# Altium project PMSM_Motor_Controller_v2_2023.PrjPcb (part 1 of 2)
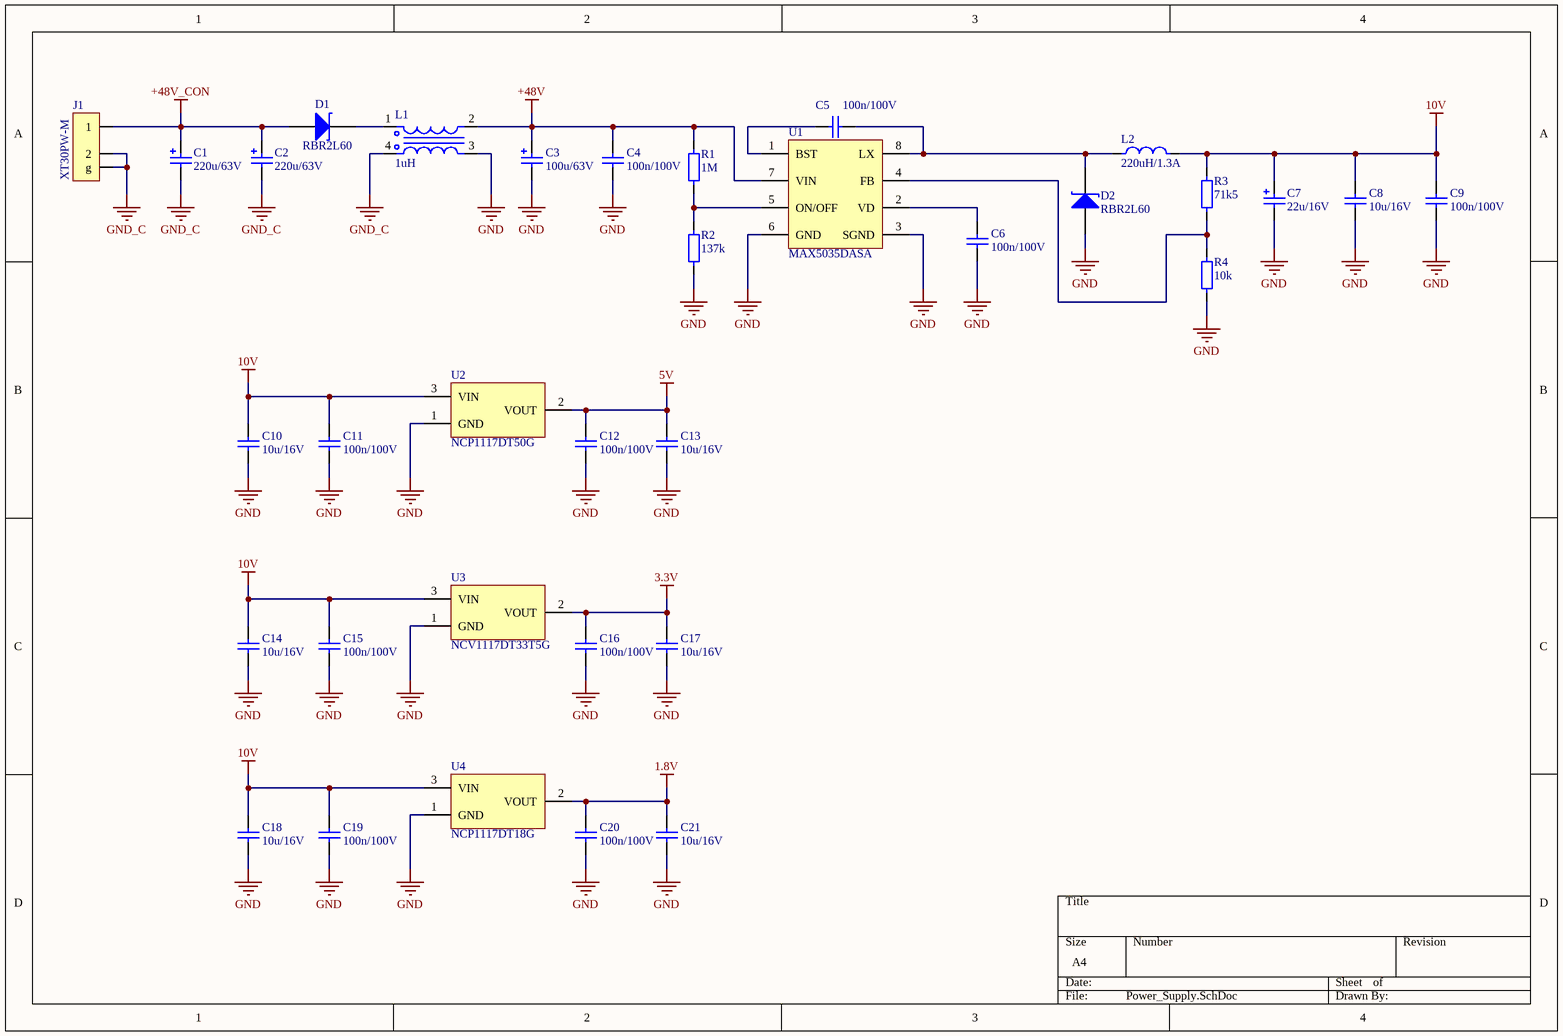
[diagram p0: Power_Supply.SchDoc]
7 sheets, 291 parts. Net scope: global (net labels, ports and power ports of the same name join across sheets).
Board file: PMSM_Motor_Controller_v2_PCB.PcbDoc
Sheets:
  Power_Supply.SchDoc
  MCU.SchDoc
  ECAT0_(IN).SchDoc
  ECAT1_(OUT).SchDoc
  MOSFET.SchDoc
  Encoder.SchDoc
  IMU.SchDoc

## Sheet Power_Supply.SchDoc
size A4; SheetNumber: 1; SheetTotal: 7

### Parts
C1  220u/63V  [CAP_POL_10x20]
C2  220u/63V  [CAP_POL_10x20]
C3  100u/63V  [CAP_POL_10x12]
C4  value 100n/100V  [CAP_0805N]  (hidden comment: 100n/100V/0805)
C5  value 100n/100V  [CAP_0805N]  (hidden comment: 100n/100V/0805)
C6  value 100n/100V  [CAP_0805N]  (hidden comment: 100n/100V/0805)
C7  22u/16V  [CAPCP3528X20N]
C8  value 10u/16V  [CAP_0805N]  (hidden comment: 10u/16V/0805)
C9  value 100n/100V  [CAP_0805N]  (hidden comment: 100n/100V/0805)
C10  value 10u/16V  [CAP_0805N]  (hidden comment: 10u/16V/0805)
C11  value 100n/100V  [CAP_0805N]  (hidden comment: 100n/100V/0805)
C12  value 100n/100V  [CAP_0805N]  (hidden comment: 100n/100V/0805)
C13  value 10u/16V  [CAP_0805N]  (hidden comment: 10u/16V/0805)
C14  value 10u/16V  [CAP_0805N]  (hidden comment: 10u/16V/0805)
C15  value 100n/100V  [CAP_0805N]  (hidden comment: 100n/100V/0805)
C16  value 100n/100V  [CAP_0805N]  (hidden comment: 100n/100V/0805)
C17  value 10u/16V  [CAP_0805N]  (hidden comment: 10u/16V/0805)
C18  value 10u/16V  [CAP_0805N]  (hidden comment: 10u/16V/0805)
C19  value 100n/100V  [CAP_0805N]  (hidden comment: 100n/100V/0805)
C20  value 100n/100V  [CAP_0805N]  (hidden comment: 100n/100V/0805)
C21  value 10u/16V  [CAP_0805N]  (hidden comment: 10u/16V/0805)
D1  RBR2L60  [DO-214AC]
D2  RBR2L60  [DO-214AC]
J1  XT30PW-M  [XT30_PCB]
L1  1uH  [744235601]
L2  220uH/1.3A  [INDP125125X65N]
R1  value 1M  [RES_0805N]  (hidden comment: 1M/0805)
R2  value 137k  [RES_0805N]  (hidden comment: 137k/0805)
R3  value 71k5  [RES_0805N]  (hidden comment: 137k/0805)
R4  value 10k  [RES_0805N]  (hidden comment: 137k/0805)
U1  MAX5035DASA  [SOIC-8]
U2  NCP1117DT50G  [NCP1117DT50G]
U3  NCV1117DT33T5G  [NCV1117DT33T5G]
U4  NCP1117DT18G  [NCV1117DT33T5G]

### Nets
1.8V: C20.2 C21.2 U4.2(VOUT)
3.3V: C16.2 C17.2 U3.2(VOUT)
5V: C12.2 C13.2 U2.2(VOUT)
10V: C7.2 C8.2 C9.2 C10.2 C11.2 C14.2 C15.2 C18.2 C19.2 L2.2 R3.2 U2.3(VIN) U3.3(VIN) U4.3(VIN)
+48V: C3.2 C4.2 L1.2 R1.2 U1.7(VIN)
+48V_CON: C1.2 C2.2 D1.1(A) J1.1
GND: C3.1 C4.1 C6.1 C7.1 C8.1 C9.1 C10.1 C11.1 C12.1 C13.1 C14.1 C15.1 C16.1 C17.1 C18.1 C19.1 C20.1 C21.1 D2.1(A) L1.3 R2.1 R4.1 U1.3(SGND) U1.6(GND) U2.1(GND) U3.1(GND) U4.1(GND)
GND_C: C1.1 C2.1 J1.2 J1.g L1.4
NetC5_1: C5.1 D2.2(K) L2.1 U1.8(LX)
NetC5_2: C5.2 U1.1(BST)
NetC6_2: C6.2 U1.2(VD)
NetD1_2: D1.2(K) L1.1
NetR1_1: R1.1 R2.2 U1.5(ON/OFF)
NetR3_1: R3.1 R4.2 U1.4(FB)

### Library data of the parts
C1 C2 = CAP_POL/220u/63V: Aluminum Electrolytic Capacitors - Radial Leaded 220uF 63V 20% Radial; Manufacturer: Murata; Part Number: GRM31CR61A107ME05L; Distributor: Mouser; Distributor ID: 81-GRM31CR61A107ME5L; Value: 220u/63V
C3 = CAP_POL/100u/63V: Aluminum Electrolytic Capacitors - Radial Leaded WCAP-ATUL 100uF 63V 20% Radial; Manufacturer: Murata; Part Number: GRM31CR61A107ME05L; Distributor: Mouser; Distributor ID: 81-GRM31CR61A107ME5L; Value: 100u/63V
C4-C6 C9 C11 C12 C15 C16 C19 C20 = CAP_MLCC/100n/100V/0805: Multilayer Ceramic Capacitors MLCC - SMD/SMT 100V 0.1uF X7R 0805 10%; Manufacturer: KEMET; Part Number: C0805C104J5RACTU; Distributor: Mouser; Distributor ID: 80-C0805C104J5R
C7 = CAP_POL/22u/16V: Tantalum Capacitors - Solid SMD 22uF 16V 10% L ESR; Manufacturer: Murata; Part Number: GRM31CR61A107ME05L; Distributor: Mouser; Distributor ID: 81-GRM31CR61A107ME5L; Value: 22u/16V
C8 C10 C13 C14 C17 C18 C21 = CAP_MLCC/10u/16V/0805: Multilayer Ceramic Capacitors MLCC - SMD/SMT 10UF 16V 10% 0805; Manufacturer: Murata; Part Number: C0805C106K8PACTU; Distributor: Mouser; Distributor ID: 80-C0805C106K8P
D1 D2 = RBR2L60: Schottky Diodes & Rectifiers SCHOTTKY BARRIER DIODE; Manufacturer: ROHM Semiconductor; Part Number: RBR2L60ADDTE25; Distributor: Mouser; Distributor ID: 755-RBR2L60ADDTE25
J1 = XT30_PCB: Gniazdo; zasilające DC; XT30; męskie; PIN: 2; na PCB; THT; 15A; 500V
L1 = CMC_744235601: Common Mode Chokes / Filters WE-CNSW 1812 1200mA 1uH 100kHz AECQ200; Manufacturer: Würth Elektronik; Part Number: 744282010; Distributor 1: Digikey; Distributor 1 ID: 732-2965-1-ND; Second Source: *; Value: 1uH
L2 = SRR1260-221K: Fixed Inductors 220uH 10% SMD 1260; Manufacturer: Bourns; Distributor: Mouser; Distributor ID: 652-SRR1260-221K; Part Number: SRR1260-221K
R1 = RES/1M/1%/0805: Thick Film Resistors - SMD .125watt 1Mohms 1% 0805 100ppm; Manufacturer: Vishay; Part Number: CRCW080510R0FKEAC; Distributor: Mouser; Distributor ID: 71-CRCW080510R0FKEAC
R2-R4 = RES/137k/1%/0805: Thick Film Resistors - SMD 1/8Watt 137kohms 1% Commercial Use; Manufacturer: Vishay; Part Number: CRCW080510R0FKEAC; Distributor: Mouser; Distributor ID: 71-CRCW080510R0FKEAC
U1 = MAX5035DASA: Switching Voltage Regulators 1A, 76V, High-Efficiency MAXPower Step-Down DC-DC Converter / MAX5035DASA; Manufacturer: Maxim Integrated; Part Number: MAX5035DASA+; Distributor: Mouser; Distributor ID: 700-MAX5035DASA
U2 = NCP1117DT50G: NCP1117DT50G / LDO 5V 1A
U3 = NCV1117DT33T5G: LDO 3.3V / NCV1117DT33T5G
U4 = NCP1117DT18RKG: NCP1117DT18RKG / LDO 1,8V 1A

## Sheet MCU.SchDoc
size A3; SheetNumber: 2; SheetTotal: 7
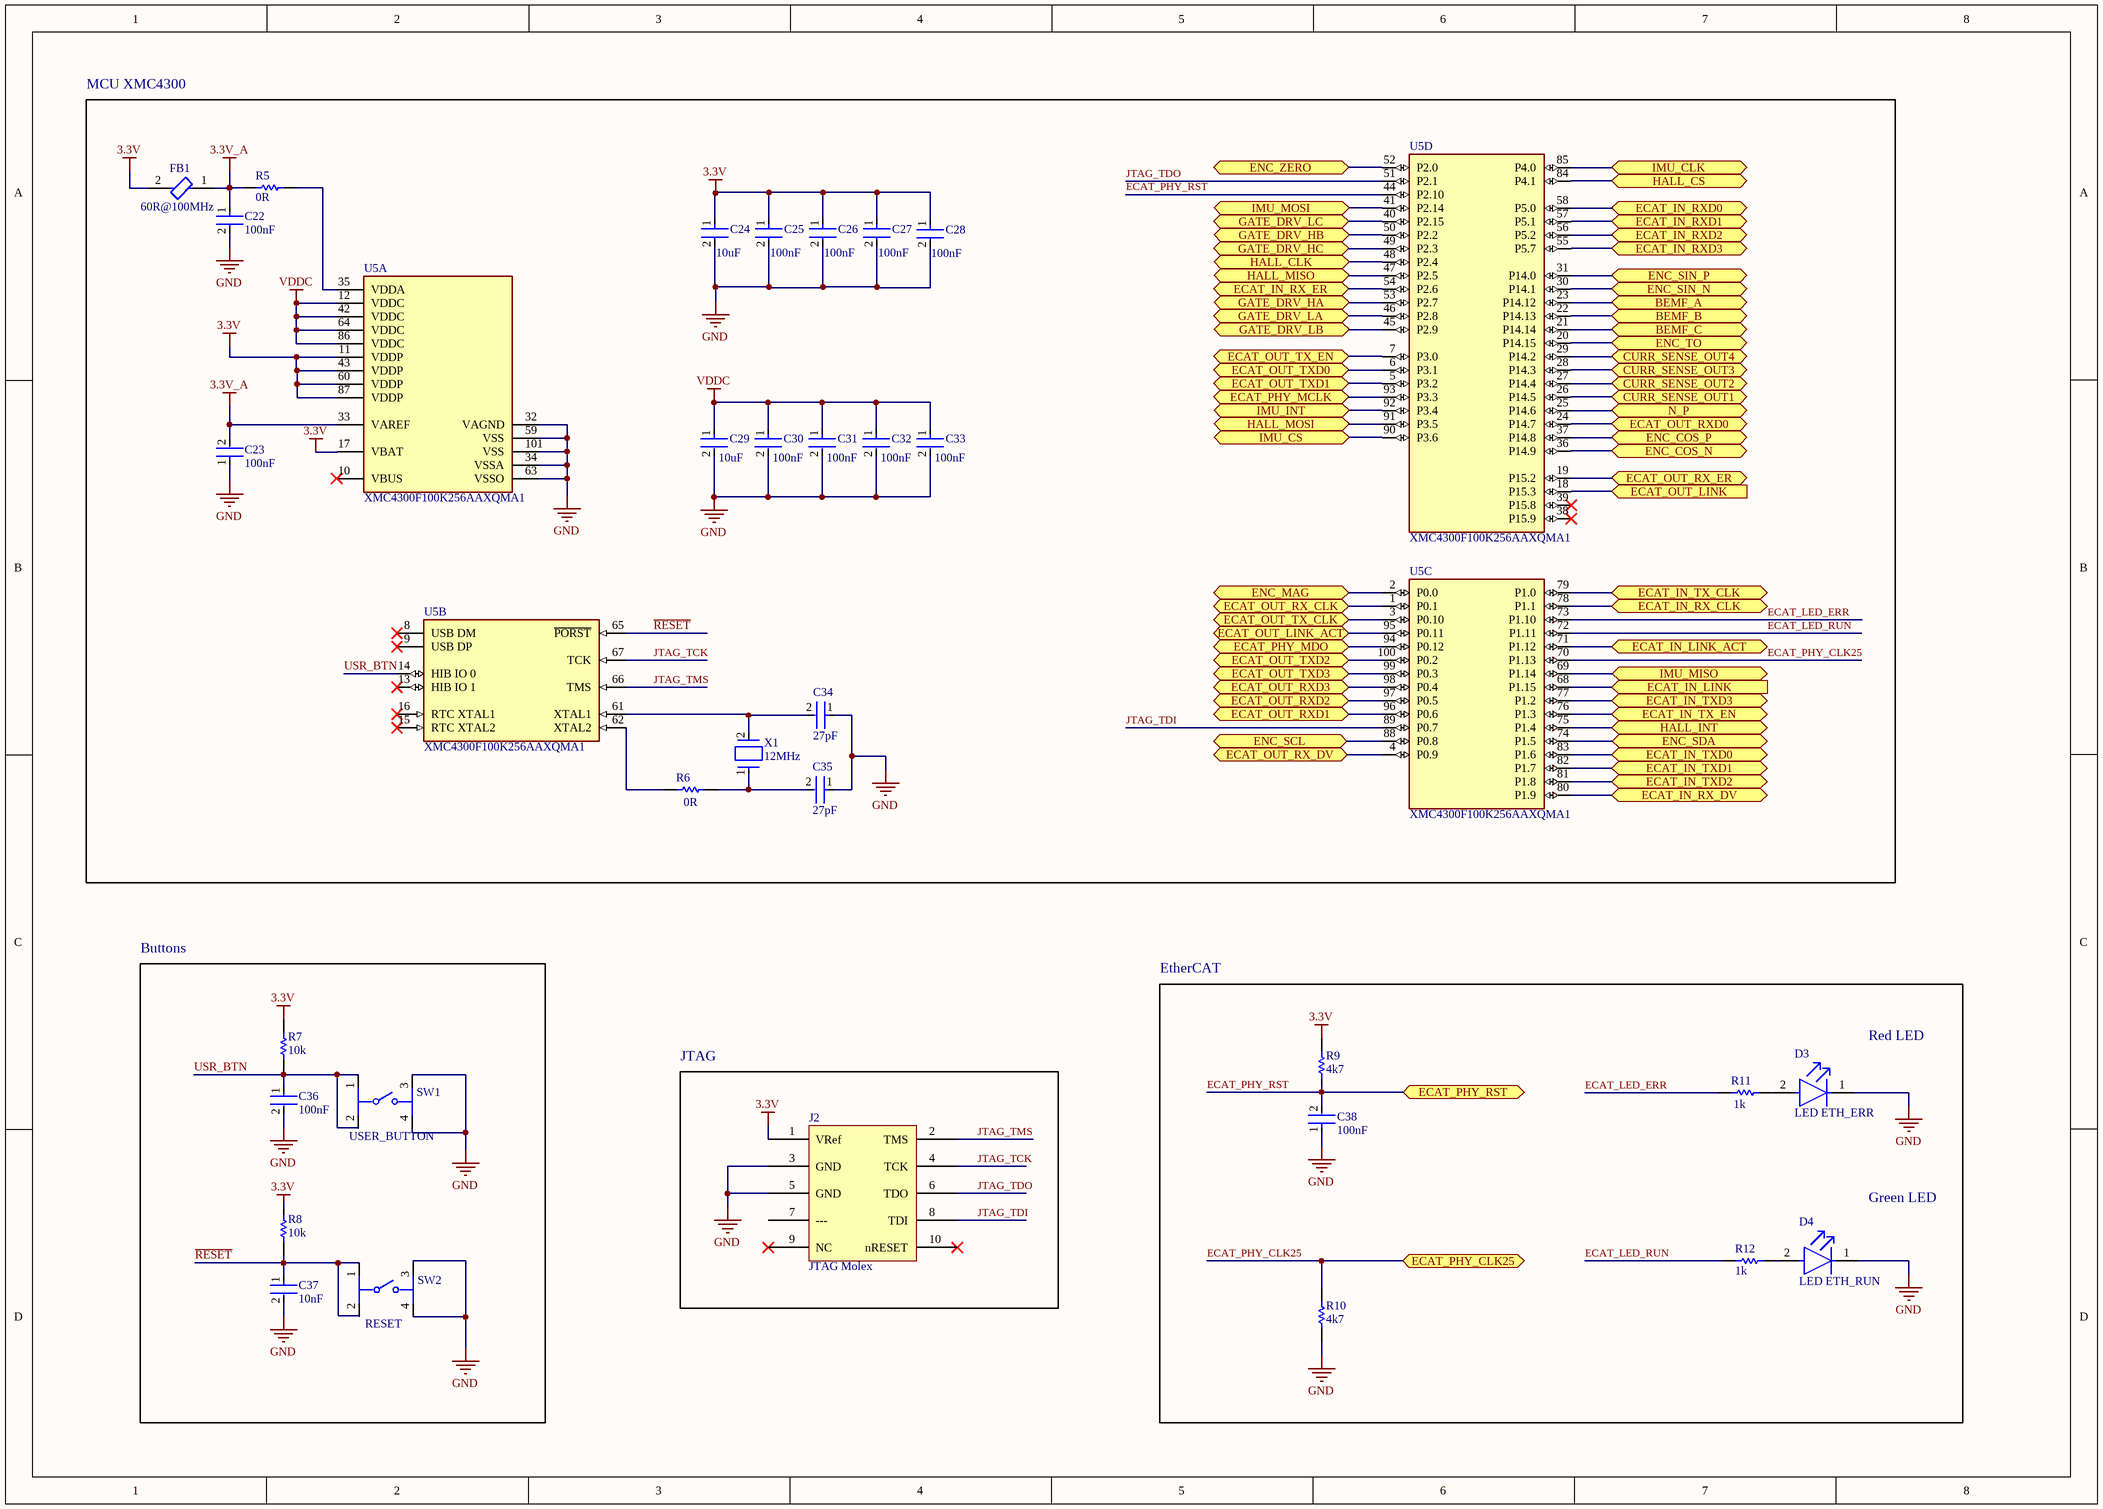
[diagram p1: MCU.SchDoc]

### Parts
C22  100nF  [FP-C0805C-DN-MFG]
C23  100nF  [FP-C0805C-DN-MFG]
C24  10uF  [FP-C0805C-DN-MFG]
C25  100nF  [FP-C0805C-DN-MFG]
C26  100nF  [FP-C0805C-DN-MFG]
C27  100nF  [FP-C0805C-DN-MFG]
C28  100nF  [FP-C0805C-DN-MFG]
C29  10uF  [FP-C0805C-DN-MFG]
C30  100nF  [FP-C0805C-DN-MFG]
C31  100nF  [FP-C0805C-DN-MFG]
C32  100nF  [FP-C0805C-DN-MFG]
C33  100nF  [FP-C0805C-DN-MFG]
C34  27pF  [FP-C0805C-DN-MFG]
C35  27pF  [FP-C0805C-DN-MFG]
C36  100nF  [FP-C0805C-DN-MFG]
C37  10nF  [FP-C0805C-DN-MFG]
C38  100nF  [FP-C0805C-DN-MFG]
D3  LED ETH_ERR  [FP-LTST-C191GKT-MFG]
D4  LED ETH_RUN  [FP-LTST-C191GKT-MFG]
FB1  60R@100MHz  [FP-BLM18-0_15-t0_8-IPC_C]
J2  JTAG Molex  [2X5_JTAG_HEADER]
R5  0R  [RESC2013X50X30LL20T20]
R6  0R  [RESC2013X50X30LL20T20]
R7  10k  [RESC2013X50X30LL20T20]
R8  10k  [RESC2013X50X30LL20T20]
R9  4k7  [RESC2013X50X30LL20T20]
R10  4k7  [RESC2013X50X30LL20T20]
R11  1k  [RESC2013X50X30LL20T20]
R12  1k  [RESC2013X50X30LL20T20]
SW1  USER_BUTTON  [FP-TL3305AF260QG-MFG]
SW2  RESET  [FP-TL3305AF260QG-MFG]
U5  XMC4300F100K256AAXQMA1  [FP-PG-LQFP-100-MFG]  (parts A,B,C,D of 4)
X1  12MHz  [FP-ABM3-MFG]

### Blocks framed on the sheet
MCU XMC4300: C22-C35 FB1 R5 R6 U5 X1
Buttons: C36 C37 R7 R8 SW1 SW2
JTAG: J2

### Ports
BEMF_A (bidir, see MOSFET[4A]), BEMF_B (bidir, see MOSFET[4B]), BEMF_C (bidir, see MOSFET[4B]), CURR_SENSE_OUT1 (bidir, see MOSFET[1C]), CURR_SENSE_OUT2 (bidir, see MOSFET[1C]), CURR_SENSE_OUT3 (bidir, see MOSFET[1C]), CURR_SENSE_OUT4 (bidir, see MOSFET[1C]), ECAT_IN_LINK (in, see ECAT0_(IN)[3D]), ECAT_IN_LINK_ACT (bidir, see ECAT0_(IN)[3D]), ECAT_IN_RX_CLK (bidir, see ECAT0_(IN)[1C]), ECAT_IN_RX_DV (bidir, see ECAT0_(IN)[1C]), ECAT_IN_RX_ER (bidir, see ECAT0_(IN)[1C]), ECAT_IN_RXD0 (bidir, see ECAT0_(IN)[4C]), ECAT_IN_RXD1 (bidir, see ECAT0_(IN)[4C]), ECAT_IN_RXD2 (bidir, see ECAT0_(IN)[4C]), ECAT_IN_RXD3 (bidir, see ECAT0_(IN)[4C]), ECAT_IN_TX_CLK (bidir, see ECAT0_(IN)[1B]), ECAT_IN_TX_EN (bidir, see ECAT0_(IN)[1B]), ECAT_IN_TXD0 (bidir, see ECAT0_(IN)[1B]), ECAT_IN_TXD1 (bidir, see ECAT0_(IN)[1B]), ECAT_IN_TXD2 (bidir, see ECAT0_(IN)[1C]), ECAT_IN_TXD3 (bidir, see ECAT0_(IN)[1C]), ECAT_OUT_LINK (in, see ECAT1_(OUT)[4D]), ECAT_OUT_LINK_ACT (bidir, see ECAT1_(OUT)[4D]), ECAT_OUT_RX_CLK (bidir, see ECAT1_(OUT)[1C]), ECAT_OUT_RX_DV (bidir, see ECAT1_(OUT)[1C]), ECAT_OUT_RX_ER (bidir, see ECAT1_(OUT)[1C]), ECAT_OUT_RXD0 (bidir, see ECAT1_(OUT)[4C]), ECAT_OUT_RXD1 (bidir, see ECAT1_(OUT)[4C]), ECAT_OUT_RXD2 (bidir, see ECAT1_(OUT)[4C]), ECAT_OUT_RXD3 (bidir, see ECAT1_(OUT)[4C]), ECAT_OUT_TX_CLK (bidir, see ECAT1_(OUT)[1B]), ECAT_OUT_TX_EN (bidir, see ECAT1_(OUT)[1C]), ECAT_OUT_TXD0 (bidir, see ECAT1_(OUT)[1C]), ECAT_OUT_TXD1 (bidir, see ECAT1_(OUT)[1C]), ECAT_OUT_TXD2 (bidir, see ECAT1_(OUT)[1C]), ECAT_OUT_TXD3 (bidir, see ECAT1_(OUT)[1C]), ECAT_PHY_CLK25 (bidir, see ECAT0_(IN)[4B], ECAT1_(OUT)[4B]), ECAT_PHY_MCLK (bidir, see ECAT0_(IN)[1C], ECAT1_(OUT)[1C]), ECAT_PHY_MDO (bidir, see ECAT0_(IN)[1C], ECAT1_(OUT)[1C]), ECAT_PHY_RST (bidir, see ECAT0_(IN)[1C], ECAT1_(OUT)[1C]), ENC_COS_N (bidir, see Encoder[3B]), ENC_COS_P (bidir, see Encoder[3C]), ENC_MAG (bidir, see Encoder[1A]), ENC_SCL (bidir, see Encoder[2A]), ENC_SDA (bidir, see Encoder[2A]), ENC_SIN_N (bidir, see Encoder[3B]), ENC_SIN_P (bidir, see Encoder[3B]), ENC_TO (bidir, see Encoder[2C]), ENC_ZERO (bidir, see Encoder[1A]), GATE_DRV_HA (bidir, see MOSFET[1A]), GATE_DRV_HB (bidir, see MOSFET[1A]), GATE_DRV_HC (bidir, see MOSFET[1A]), GATE_DRV_LA (bidir, see MOSFET[1B]), GATE_DRV_LB (bidir, see MOSFET[1B]), GATE_DRV_LC (bidir, see MOSFET[1B]), HALL_CLK (bidir, see Encoder[3A]), HALL_CS (bidir, see Encoder[3A]), HALL_INT (bidir, see Encoder[3B]), HALL_MISO (bidir, see Encoder[3A]), HALL_MOSI (bidir, see Encoder[3A]), IMU_CLK (bidir, see IMU[2B]), IMU_CS (bidir, see IMU[2B]), IMU_INT (bidir, see IMU[2B]), IMU_MISO (bidir, see IMU[2B]), IMU_MOSI (bidir, see IMU[2B]), N_P (bidir, see MOSFET[4C])

### Nets
3.3V: C24.1 C25.1 C26.1 C27.1 C28.1 FB1.2 J2.1(VRef) R7.1 R8.1 R9.2 U5.11(VDDP) U5.17(VBAT) U5.43(VDDP) U5.60(VDDP) U5.87(VDDP)
3.3V_A: C22.1 C23.2 FB1.1 R5.1 U5.33(VAREF)
GND: C22.2 C23.1 C24.2 C25.2 C26.2 C27.2 C28.2 C29.2 C30.2 C31.2 C32.2 C33.2 C34.1 C35.1 C36.2 C37.2 C38.1 D3.1(C) D4.1(C) J2.3(GND) J2.5(GND) R10.1 SW1.3 SW1.4 SW2.3 SW2.4 U5.32(VAGND) U5.34(VSSA) U5.59(VSS) U5.63(VSSO) U5.101(VSS)
VDDC: C29.1 C30.1 C31.1 C32.1 C33.1 U5.12(VDDC) U5.42(VDDC) U5.64(VDDC) U5.86(VDDC)
BEMF_A: U5.23(P14.12) ; port BEMF_A
BEMF_B: U5.22(P14.13) ; port BEMF_B
BEMF_C: U5.21(P14.14) ; port BEMF_C
CURR_SENSE_OUT1: U5.26(P14.5) ; port CURR_SENSE_OUT1
CURR_SENSE_OUT2: U5.27(P14.4) ; port CURR_SENSE_OUT2
CURR_SENSE_OUT3: U5.28(P14.3) ; port CURR_SENSE_OUT3
CURR_SENSE_OUT4: U5.29(P14.2) ; port CURR_SENSE_OUT4
ECAT_IN_LINK: U5.68(P1.15) ; port ECAT_IN_LINK
ECAT_IN_LINK_ACT: U5.71(P1.12) ; port ECAT_IN_LINK_ACT
ECAT_IN_RX_CLK: U5.78(P1.1) ; port ECAT_IN_RX_CLK
ECAT_IN_RX_DV: U5.80(P1.9) ; port ECAT_IN_RX_DV
ECAT_IN_RX_ER: U5.54(P2.6) ; port ECAT_IN_RX_ER
ECAT_IN_RXD0: U5.58(P5.0) ; port ECAT_IN_RXD0
ECAT_IN_RXD1: U5.57(P5.1) ; port ECAT_IN_RXD1
ECAT_IN_RXD2: U5.56(P5.2) ; port ECAT_IN_RXD2
ECAT_IN_RXD3: U5.55(P5.7) ; port ECAT_IN_RXD3
ECAT_IN_TX_CLK: U5.79(P1.0) ; port ECAT_IN_TX_CLK
ECAT_IN_TX_EN: U5.76(P1.3) ; port ECAT_IN_TX_EN
ECAT_IN_TXD0: U5.83(P1.6) ; port ECAT_IN_TXD0
ECAT_IN_TXD1: U5.82(P1.7) ; port ECAT_IN_TXD1
ECAT_IN_TXD2: U5.81(P1.8) ; port ECAT_IN_TXD2
ECAT_IN_TXD3: U5.77(P1.2) ; port ECAT_IN_TXD3
ECAT_LED_ERR: R11.1 U5.73(P1.10)
ECAT_LED_RUN: R12.1 U5.72(P1.11)
ECAT_OUT_LINK: U5.18(P15.3) ; port ECAT_OUT_LINK
ECAT_OUT_LINK_ACT: U5.95(P0.11) ; port ECAT_OUT_LINK_ACT
ECAT_OUT_RX_CLK: U5.1(P0.1) ; port ECAT_OUT_RX_CLK
ECAT_OUT_RX_DV: U5.4(P0.9) ; port ECAT_OUT_RX_DV
ECAT_OUT_RX_ER: U5.19(P15.2) ; port ECAT_OUT_RX_ER
ECAT_OUT_RXD0: U5.24(P14.7) ; port ECAT_OUT_RXD0
ECAT_OUT_RXD1: U5.96(P0.6) ; port ECAT_OUT_RXD1
ECAT_OUT_RXD2: U5.97(P0.5) ; port ECAT_OUT_RXD2
ECAT_OUT_RXD3: U5.98(P0.4) ; port ECAT_OUT_RXD3
ECAT_OUT_TX_CLK: U5.3(P0.10) ; port ECAT_OUT_TX_CLK
ECAT_OUT_TX_EN: U5.7(P3.0) ; port ECAT_OUT_TX_EN
ECAT_OUT_TXD0: U5.6(P3.1) ; port ECAT_OUT_TXD0
ECAT_OUT_TXD1: U5.5(P3.2) ; port ECAT_OUT_TXD1
ECAT_OUT_TXD2: U5.100(P0.2) ; port ECAT_OUT_TXD2
ECAT_OUT_TXD3: U5.99(P0.3) ; port ECAT_OUT_TXD3
ECAT_PHY_CLK25: R10.2 U5.70(P1.13) ; port ECAT_PHY_CLK25
ECAT_PHY_MCLK: U5.93(P3.3) ; port ECAT_PHY_MCLK
ECAT_PHY_MDO: U5.94(P0.12) ; port ECAT_PHY_MDO
ECAT_PHY_RST: C38.2 R9.1 U5.44(P2.10) ; port ECAT_PHY_RST
ENC_COS_N: U5.36(P14.9) ; port ENC_COS_N
ENC_COS_P: U5.37(P14.8) ; port ENC_COS_P
ENC_MAG: U5.2(P0.0) ; port ENC_MAG
ENC_SCL: U5.88(P0.8) ; port ENC_SCL
ENC_SDA: U5.74(P1.5) ; port ENC_SDA
ENC_SIN_N: U5.30(P14.1) ; port ENC_SIN_N
ENC_SIN_P: U5.31(P14.0) ; port ENC_SIN_P
ENC_TO: U5.20(P14.15) ; port ENC_TO
ENC_ZERO: U5.52(P2.0) ; port ENC_ZERO
GATE_DRV_HA: U5.53(P2.7) ; port GATE_DRV_HA
GATE_DRV_HB: U5.50(P2.2) ; port GATE_DRV_HB
GATE_DRV_HC: U5.49(P2.3) ; port GATE_DRV_HC
GATE_DRV_LA: U5.46(P2.8) ; port GATE_DRV_LA
GATE_DRV_LB: U5.45(P2.9) ; port GATE_DRV_LB
GATE_DRV_LC: U5.40(P2.15) ; port GATE_DRV_LC
HALL_CLK: U5.48(P2.4) ; port HALL_CLK
HALL_CS: U5.84(P4.1) ; port HALL_CS
HALL_INT: U5.75(P1.4) ; port HALL_INT
HALL_MISO: U5.47(P2.5) ; port HALL_MISO
HALL_MOSI: U5.91(P3.5) ; port HALL_MOSI
IMU_CLK: U5.85(P4.0) ; port IMU_CLK
IMU_CS: U5.90(P3.6) ; port IMU_CS
IMU_INT: U5.92(P3.4) ; port IMU_INT
IMU_MISO: U5.69(P1.14) ; port IMU_MISO
IMU_MOSI: U5.41(P2.14) ; port IMU_MOSI
JTAG_TCK: J2.4(TCK) U5.67(TCK)
JTAG_TDI: J2.8(TDI) U5.89(P0.7)
JTAG_TDO: J2.6(TDO) U5.51(P2.1)
JTAG_TMS: J2.2(TMS) U5.66(TMS)
N_P: U5.25(P14.6) ; port N_P
~{RESET}: C37.1 R8.2 SW2.1 SW2.2 U5.65(~{PORST})
USR_BTN: C36.1 R7.2 SW1.1 SW1.2 U5.14(HIB_IO_0)
NetC34_2: C34.2 U5.61(XTAL1) X1.2
NetC35_2: C35.2 R6.2 X1.1
NetD3_2: D3.2(A) R11.2
NetD4_2: D4.2(A) R12.2
NetR5_2: R5.2 U5.35(VDDA)
NetR6_1: R6.1 U5.62(XTAL2)

Not connected (* = marked no-connect by the designer): J2 7(---) 9(NC)* 10(nRESET)*; U5 8(USB_DM)* 9(USB_DP)* 10(VBUS)* 13(HIB_IO_1)* 15(RTC_XTAL2)* 16(RTC_XTAL1)* 38(P15.9)* 39(P15.8)*

### Notes on the sheet
- EtherCAT
- Red LED
- Green LED

### Library data of the parts
C22-C38 = CMP-2007-00279-2: CAP CER 0.1UF 50V X7R 0805; Manufacturer Part Number: C0805C104K5RACTU; Manufacturer: KEMET; Value: 0.10 μF; Tolerance: 0.1; Temperature Coefficient: 30ppm/°C; Material: Ceramic; Device Class L2: Capacitors; Temperature Range Low: -55°C; Voltage Rating: 50 V; Digikey Description: CAP CER 0.1UF 50V X7R 0805; Category: Cap; ComponentLink2Description: Datasheet; Octopart: https://octopart.com/c0805c104k5ractu-kemet-143926; RoHS: TRUE; ComponentLink2URL: https://content.kemet.com/datasheets/KEM_C1003_C0G_SMD.pdf; Temperature Characteristic: X7R; Temperature: -55°C to +125°C; Height: 0.88mm; Temperature Range High: +125°C; Device Class L1: Passive Components; Automotive: No; Lead Free: Yes; Ipc Land Pattern Name: CAPC200125X78; Device Class L3: Ceramic Capacitors; Mouser Description: Cap Ceramic 0.1uF 50V X7R 10% SMD 2.0 x 1.2 mm 125 C Paper T/R; Capacitance: 0.10 μF; Package: C0805C-DN
D3 D4 = CMP-22017-000029-1: KPHD-1608LVCGCK; Power Dissipation: 100mW; Lens Color: Colorless; Number of Elements: 1; Dominant Wavelength: 569nm; Illumination Color: Green; Lens Style: Clear; Forward Voltage: 2.1V; Forward Current: 30mA; Test Current: 20mA; Viewing Angle: 130°; Wavelength: 565nm; Luminous Intensity: 12mcd; Reverse Voltage: 5V; Case/Package: 0603; Package Quantity: 1; Lens Transparency: Clear; Depth: 0.8mm; Power Rating: 100mW; Width: 0.8mm; Height: 0.55mm; Radiation Hardening: No; Case Code (Imperial): 0603; Number of Pins: 2; Length: 1.6mm; Case Code (Metric): 1608; Max Operating Temperature: 85°C; Color: Green; Packaging: Tape and Reel; Mount: Surface Mount; Min Operating Temperature: -55°C; Lead Free: Lead Free; Number of LEDs: 1
FB1 = CMP-06046-002563-1: Chip Ferrite Bead, 0603, 60Ω @ 100MHz, 0.1Ω, , 1A / BLM18PG600SH1D; Max Current Rating: 500mA; Impedance: 60R; DC Resistance (DCR): 100mR; Number of Circuits: 1; Material: Steel; Tolerance: 25%; Shielding: Unshielded; Ratings: AEC-Q200; Height: 0.8mm; Mount: Surface Mount; RoHS Compliant: Yes; Case Code (Metric): 1608; Package Quantity: 4000; Length: 1.6mm; REACH SVHC: No SVHC; Width: 0.8mm; Number of Lines: 1; Contact Plating: Tin; Min Operating Temperature: -55°C; Packaging: Tape and Reel; Series: EMIFIL®, BLM18P; Case/Package: 0603; Max DC Current: 500mA; Case Code (Imperial): 0603; Termination: SMD/SMT; Current Rating: 500mA; Max Operating Temperature: 125°C; Test Frequency: 100MHz
J2 = 5x2_1,27mm_JTAG: MOLEX for JTAG, 5x2, 1,27 mm
R5-R8 = CMP-2001-04896-1: Manufacturer: Vishay Dale; Part Number: CRCW08050000Z0EA
R9-R12 = CMP-2001-04896-1: 0805; Manufacturer: Vishay Dale; Part Number: CRCW08050000Z0EA
SW1 SW2 = CMP-17879-000010-1: SWITCH TACTILE SPST-NO 50MA 12V / TL3305AF260QG; Mechanical Life: 200000Cycles; Switch Function: Off-Mom; Actuator Type: Standard; Operating Force: 260gf; Illumination Type: Non-Illuminated; Switch Travel: 0.2mm; Throw Configuration: SPST; Min Operating Temperature: -20°C; Max Operating Temperature: 70°C; Lead Free: Lead Free; Mount: Surface Mount; Packaging: Tape and Reel; Termination: Gull Wing
U5 = CMP-32808-000041-1: IC MCU 32BIT 256KB FLASH 100LQFP; RoHS Compliant: Yes
X1 = CMP-27762-007917-1: Crystal 12MHz SMD-2 5mm x 3.2mm; ESR (Equivalent Series Resistance): 60R; Load Capacitance: 18pF; Tolerance: 20ppm; Frequency Stability: 30ppm; Depth: 3.2mm; Length: 5mm; Height: 0.051inch; Case/Package: CSMD; Package Quantity: 1000; Frequency: 12MHz; Packaging: Tape and Reel; Min Operating Temperature: -40°C; Operating Frequency: 12 MHz; Number of Pins: 2; Termination: SMD/SMT; Mount: Surface Mount; Width: 0.126inch; Resistor Type: Ceramic; Frequency Tolerance: 20ppm; Lead Free: Lead Free; Max Operating Temperature: 85°C; Radiation Hardening: No; Series Resistance: 60R; Series: ABM3

## Sheet ECAT0_(IN).SchDoc
size A3; SheetNumber: 3; SheetTotal: 7
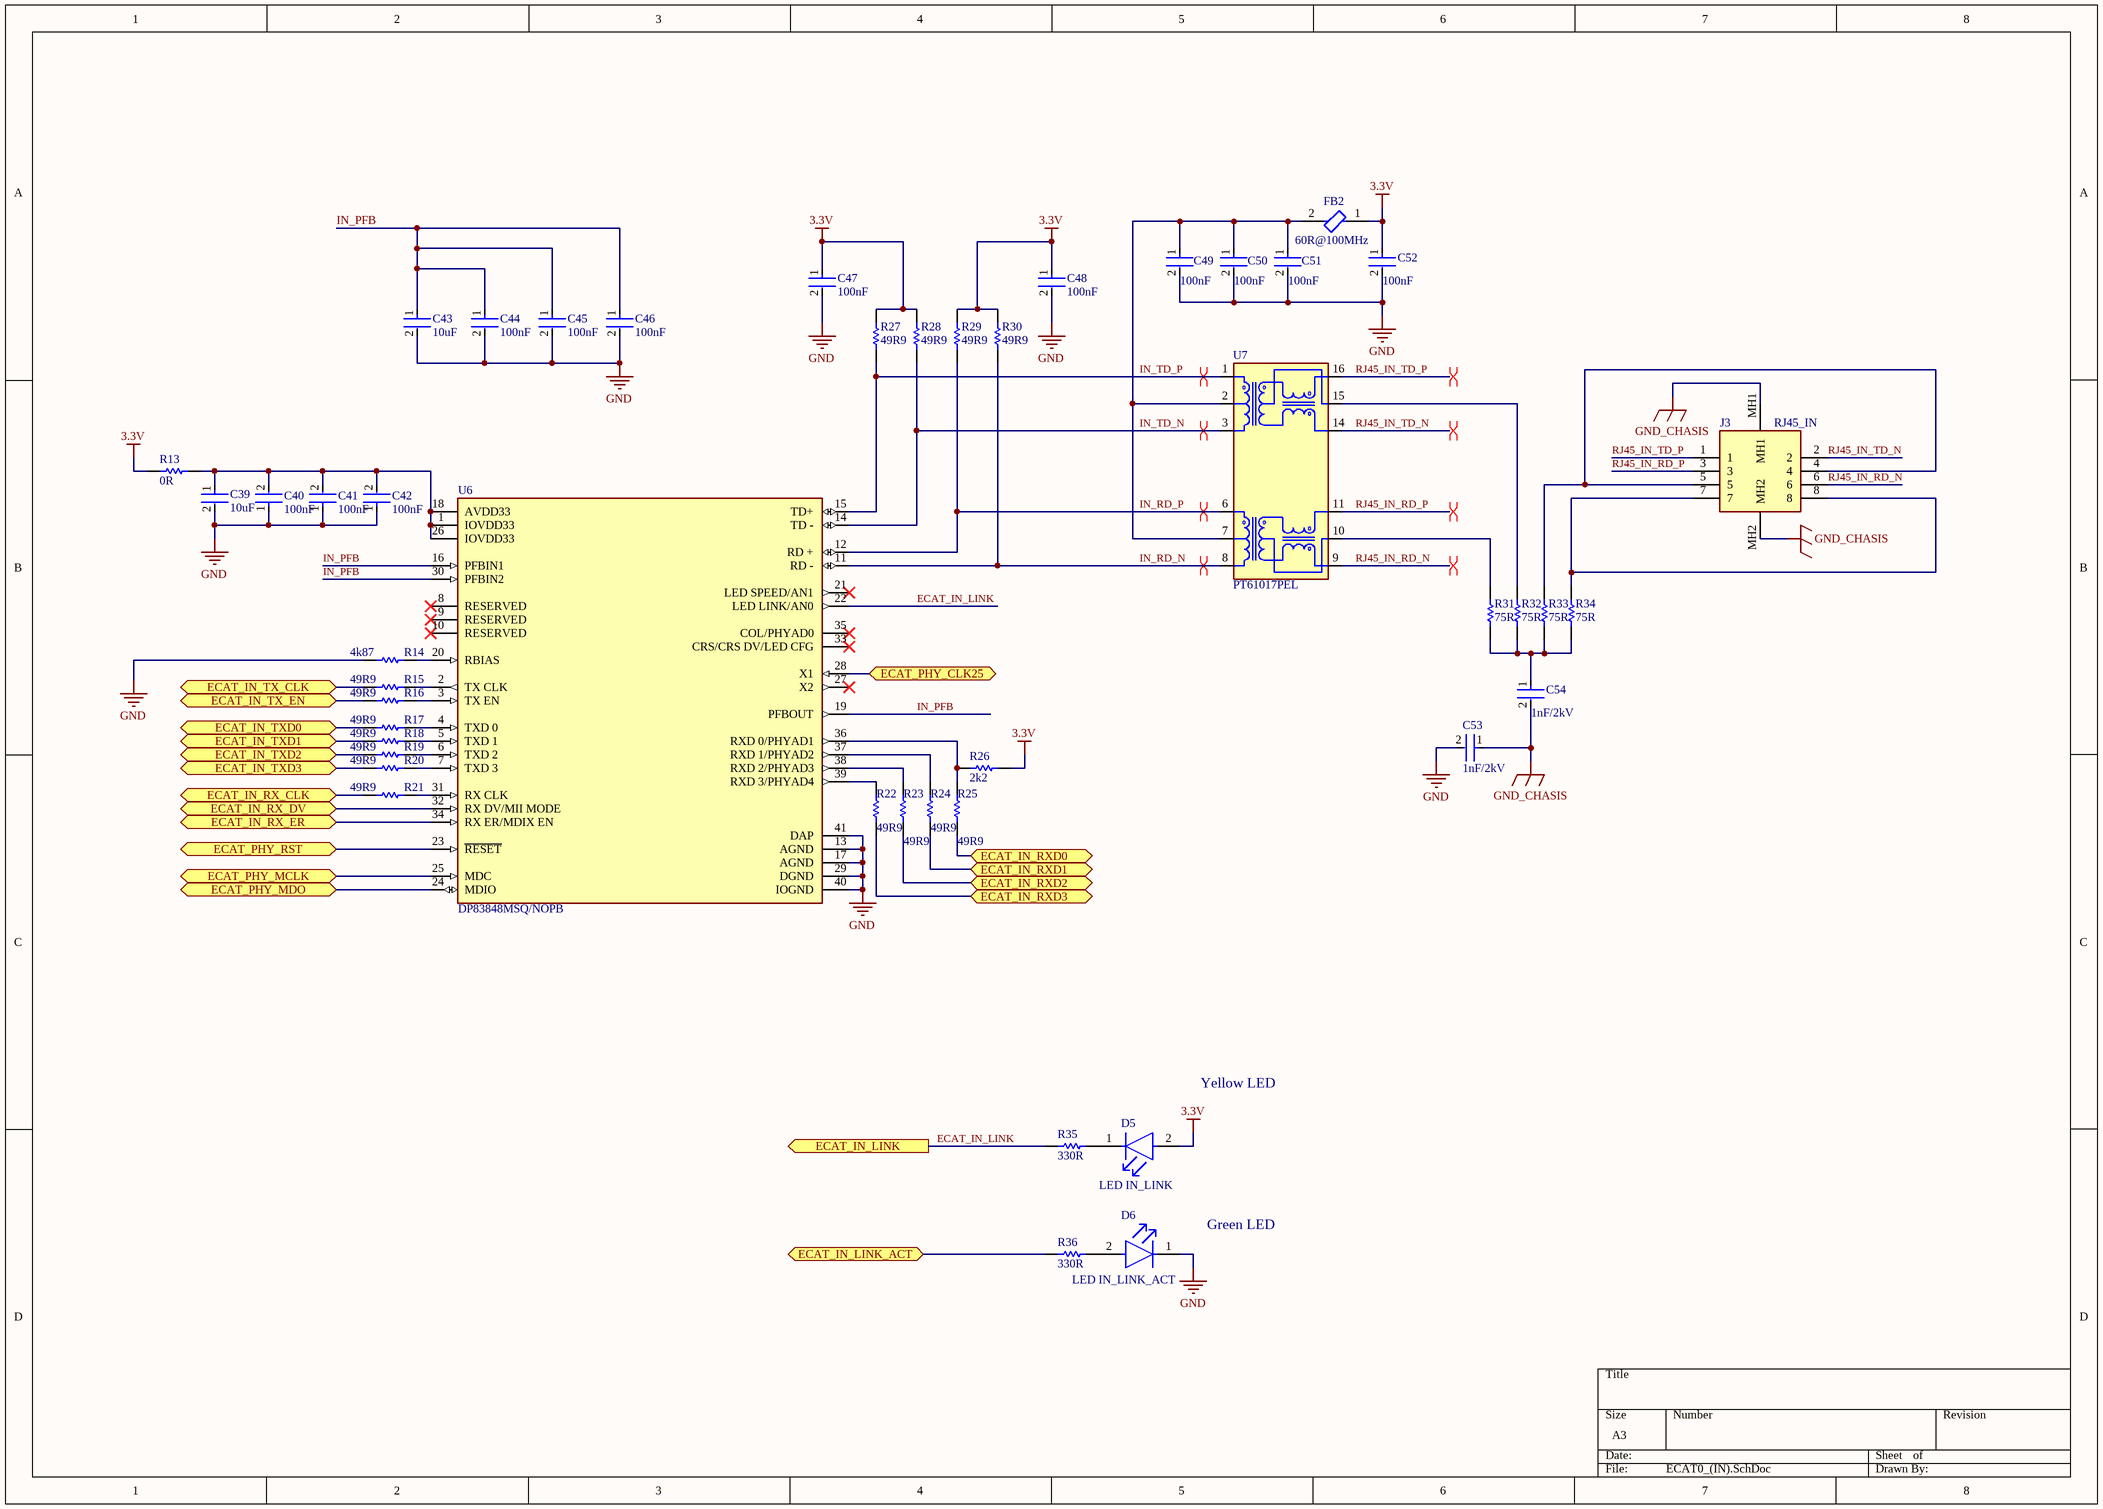
[diagram p2: ECAT0_(IN).SchDoc]

### Parts
C39  10uF  [FP-C0805C-DN-MFG]
C40  100nF  [FP-C0805C-DN-MFG]
C41  100nF  [FP-C0805C-DN-MFG]
C42  100nF  [FP-C0805C-DN-MFG]
C43  10uF  [FP-C0805C-DN-MFG]
C44  100nF  [FP-C0805C-DN-MFG]
C45  100nF  [FP-C0805C-DN-MFG]
C46  100nF  [FP-C0805C-DN-MFG]
C47  100nF  [FP-C0805C-DN-MFG]
C48  100nF  [FP-C0805C-DN-MFG]
C49  100nF  [FP-C0805C-DN-MFG]
C50  100nF  [FP-C0805C-DN-MFG]
C51  100nF  [FP-C0805C-DN-MFG]
C52  100nF  [FP-C0805C-DN-MFG]
C53  1nF/2kV  [FP-CC1206-0_3-1_45-IPC_C]
C54  1nF/2kV  [FP-CC1206-0_3-1_45-IPC_C]
D5  LED IN_LINK  [FP-LTST-C191GKT-MFG]
D6  LED IN_LINK_ACT  [FP-LTST-C191GKT-MFG]
FB2  60R@100MHz  [FP-BLM18-0_15-t0_8-IPC_B]
J3  RJ45_IN  [438600010]
R13  0R  [RESC1609X50X30NL8T20]
R14  4k87  [RESC2013X50X30LL20T20]
R15  49R9  [RESC2013X50X30LL20T20]
R16  49R9  [RESC2013X50X30LL20T20]
R17  49R9  [RESC2013X50X30LL20T20]
R18  49R9  [RESC2013X50X30LL20T20]
R19  49R9  [RESC2013X50X30LL20T20]
R20  49R9  [RESC2013X50X30LL20T20]
R21  49R9  [RESC2013X50X30LL20T20]
R22  49R9  [RESC2013X50X30LL20T20]
R23  49R9  [RESC2013X50X30LL20T20]
R24  49R9  [RESC2013X50X30LL20T20]
R25  49R9  [RESC2013X50X30LL20T20]
R26  2k2  [RESC2013X50X30LL20T20]
R27  49R9  [RESC2013X50X30LL20T20]
R28  49R9  [RESC2013X50X30LL20T20]
R29  49R9  [RESC2013X50X30LL20T20]
R30  49R9  [RESC2013X50X30LL20T20]
R31  75R  [RESC2013X50X30LL20T20]
R32  75R  [RESC2013X50X30LL20T20]
R33  75R  [RESC2013X50X30LL20T20]
R34  75R  [RESC2013X50X30LL20T20]
R35  330R  [RESC2013X50X30LL20T20]
R36  330R  [RESC2013X50X30LL20T20]
U6  DP83848MSQ/NOPB  [FP-RTA0040A-IPC_B]
U7  PT61017PEL  [PT61017PEL]

### Ports
ECAT_IN_LINK (out, see MCU[7B]), ECAT_IN_LINK_ACT (bidir, see MCU[7B]), ECAT_IN_RX_CLK (bidir, see MCU[7B]), ECAT_IN_RX_DV (bidir, see MCU[7C]), ECAT_IN_RX_ER (bidir, see MCU[5A]), ECAT_IN_RXD0 (bidir, see MCU[7A]), ECAT_IN_RXD1 (bidir, see MCU[7A]), ECAT_IN_RXD2 (bidir, see MCU[7A]), ECAT_IN_RXD3 (bidir, see MCU[7A]), ECAT_IN_TX_CLK (bidir, see MCU[7B]), ECAT_IN_TX_EN (bidir, see MCU[7B]), ECAT_IN_TXD0 (bidir, see MCU[7C]), ECAT_IN_TXD1 (bidir, see MCU[7C]), ECAT_IN_TXD2 (bidir, see MCU[7C]), ECAT_IN_TXD3 (bidir, see MCU[7B]), ECAT_PHY_CLK25 (bidir, see ECAT1_(OUT)[4B], MCU[6D]), ECAT_PHY_MCLK (bidir, see ECAT1_(OUT)[1C], MCU[5B]), ECAT_PHY_MDO (bidir, see ECAT1_(OUT)[1C], MCU[5B]), ECAT_PHY_RST (bidir, see ECAT1_(OUT)[1C], MCU[6C])

### Nets
3.3V: C47.1 C48.1 C52.1 D5.2(A) FB2.1 R13.2 R26.1 R27.2 R28.2 R29.2 R30.2
GND: C39.2 C40.1 C41.1 C42.1 C43.2 C44.2 C45.2 C46.2 C47.2 C48.2 C49.2 C50.2 C51.2 C52.2 C53.2 D6.1(C) R14.1 U6.13(AGND) U6.17(AGND) U6.29(DGND) U6.40(IOGND) U6.41(DAP)
GND_CHASIS: C53.1 C54.2 J3.MH1 J3.MH2
ECAT_IN_LINK: R35.1 U6.22(LED_LINK/AN0) ; port ECAT_IN_LINK
ECAT_IN_LINK_ACT: R36.1 ; port ECAT_IN_LINK_ACT
ECAT_IN_RX_CLK: R21.1 ; port ECAT_IN_RX_CLK
ECAT_IN_RX_DV: U6.32(RX_DV/MII_MODE) ; port ECAT_IN_RX_DV
ECAT_IN_RX_ER: U6.34(RX_ER/MDIX_EN) ; port ECAT_IN_RX_ER
ECAT_IN_RXD0: R25.1 ; port ECAT_IN_RXD0
ECAT_IN_RXD1: R24.1 ; port ECAT_IN_RXD1
ECAT_IN_RXD2: R23.1 ; port ECAT_IN_RXD2
ECAT_IN_RXD3: R22.1 ; port ECAT_IN_RXD3
ECAT_IN_TX_CLK: R15.1 ; port ECAT_IN_TX_CLK
ECAT_IN_TX_EN: R16.1 ; port ECAT_IN_TX_EN
ECAT_IN_TXD0: R17.1 ; port ECAT_IN_TXD0
ECAT_IN_TXD1: R18.1 ; port ECAT_IN_TXD1
ECAT_IN_TXD2: R19.1 ; port ECAT_IN_TXD2
ECAT_IN_TXD3: R20.1 ; port ECAT_IN_TXD3
ECAT_PHY_CLK25: U6.28(X1) ; port ECAT_PHY_CLK25
ECAT_PHY_MCLK: U6.25(MDC) ; port ECAT_PHY_MCLK
ECAT_PHY_MDO: U6.24(MDIO) ; port ECAT_PHY_MDO
ECAT_PHY_RST: U6.23(~{RESET}) ; port ECAT_PHY_RST
IN_PFB: C43.1 C44.1 C45.1 C46.1 U6.16(PFBIN1) U6.19(PFBOUT) U6.30(PFBIN2)
IN_RD_N: R30.1 U6.11(RD_-) U7.8
IN_RD_P: R29.1 U6.12(RD_+) U7.6
IN_TD_N: R28.1 U6.14(TD_-) U7.3
IN_TD_P: R27.1 U6.15(TD+) U7.1
RJ45_IN_RD_N: J3.6 U7.9
RJ45_IN_RD_P: J3.3 U7.11
RJ45_IN_TD_N: J3.2 U7.14
RJ45_IN_TD_P: J3.1 U7.16
NetC39_1: C39.1 C40.2 C41.2 C42.2 R13.1 U6.1(IOVDD33) U6.18(AVDD33) U6.26(IOVDD33)
NetC49_1: C49.1 C50.1 C51.1 FB2.2 U7.2 U7.7
NetC54_1: C54.1 R31.1 R32.1 R33.1 R34.1
NetD5_1: D5.1(C) R35.2
NetD6_2: D6.2(A) R36.2
NetJ3_4: J3.4 J3.5 R33.2
NetJ3_7: J3.7 J3.8 R34.2
NetR14_2: R14.2 U6.20(RBIAS)
NetR15_2: R15.2 U6.2(TX_CLK)
NetR16_2: R16.2 U6.3(TX_EN)
NetR17_2: R17.2 U6.4(TXD_0)
NetR18_2: R18.2 U6.5(TXD_1)
NetR19_2: R19.2 U6.6(TXD_2)
NetR20_2: R20.2 U6.7(TXD_3)
NetR21_2: R21.2 U6.31(RX_CLK)
NetR22_2: R22.2 U6.39(RXD_3/PHYAD4)
NetR23_2: R23.2 U6.38(RXD_2/PHYAD3)
NetR24_2: R24.2 U6.37(RXD_1/PHYAD2)
NetR25_2: R25.2 R26.2 U6.36(RXD_0/PHYAD1)
NetR31_2: R31.2 U7.10
NetR32_2: R32.2 U7.15

Not connected (* = marked no-connect by the designer): U6 8(RESERVED)* 9(RESERVED)* 10(RESERVED)* 21(LED_SPEED/AN1)* 27(X2)* 33(CRS/CRS_DV/LED_CFG)* 35(COL/PHYAD0)*

### Layout directives
differential pair; differential pair class IN_TD: IN_TD_N, IN_TD_P
differential pair; differential pair class IN_RD: IN_RD_N, IN_RD_P
differential pair; differential pair class RJ45_IN_TD: RJ45_IN_TD_N, RJ45_IN_TD_P
differential pair; differential pair class RJ45_IN_RD: RJ45_IN_RD_N, RJ45_IN_RD_P

### Notes on the sheet
- Yellow LED
- Green LED

### Library data of the parts
C39-C52 = CMP-2007-00279-2: as C22 on sheet MCU; Device Class L2: Capacitors; Temperature Range Low: -55°C; Voltage Rating: 50 V; Digikey Description: CAP CER 0.1UF 50V X7R 0805; Category: Cap; ComponentLink2Description: Datasheet; Octopart: https://octopart.com/c0805c104k5ractu-kemet-143926; RoHS: TRUE; ComponentLink2URL: https://content.kemet.com/datasheets/KEM_C1003_C0G_SMD.pdf; Temperature Characteristic: X7R; Temperature: -55°C to +125°C; Height: 0.88mm; Temperature Range High: +125°C; Device Class L1: Passive Components; Automotive: No; Lead Free: Yes; Ipc Land Pattern Name: CAPC200125X78; Device Class L3: Ceramic Capacitors; Mouser Description: Cap Ceramic 0.1uF 50V X7R 10% SMD 2.0 x 1.2 mm 125 C Paper T/R; Capacitance: 0.10 μF; Package: C0805C-DN
C53 C54 = CMP-2000-05436-2: 1nF/2kV/1206; Voltage Rating (DC): 2kV; Capacitance: 1nF; Dielectric: X7R; Insulation Resistance: 10GR; Dissipation Factor: 2.5%; Tolerance: 10%; Termination: SMD/SMT; Case/Package: 1206; Length: 3.2mm; Depth: 1.6mm; Case Code (Imperial): 1206; Package Quantity: 1; Packaging: Tape and Reel; Mount: Surface Mount; Max Operating Temperature: 125°C; Lead Free: Lead Free; Number of Pins: 2; Thickness: 0.057inch; Width: 0.063inch; Resistor Type: Ceramic; Series: CC; RoHS Compliant: Yes; Voltage Rating: 2kV; Radiation Hardening: No; Construction: Flat; Height: 1.25mm; Min Operating Temperature: -55°C; Voltage: 2kV; Case Code (Metric): 3216
D5 = CMP-22017-000029-1: KPHD-1608LVSYCK; Power Dissipation: 100mW; Lens Color: Colorless; Number of Elements: 1; Dominant Wavelength: 569nm; Illumination Color: Green; Lens Style: Clear; Forward Voltage: 2.1V; Forward Current: 30mA; Test Current: 20mA; Viewing Angle: 130°; Wavelength: 565nm; Luminous Intensity: 12mcd; Reverse Voltage: 5V; Case/Package: 0603; Package Quantity: 1; Lens Transparency: Clear; Depth: 0.8mm; Power Rating: 100mW; Width: 0.8mm; Height: 0.55mm; Radiation Hardening: No; Case Code (Imperial): 0603; Number of Pins: 2; Length: 1.6mm; Case Code (Metric): 1608; Max Operating Temperature: 85°C; Color: Green; Packaging: Tape and Reel; Mount: Surface Mount; Min Operating Temperature: -55°C; Lead Free: Lead Free; Number of LEDs: 1
D6 = CMP-22017-000029-1: as D3 on sheet MCU; Case/Package: 0603; Package Quantity: 1; Lens Transparency: Clear; Depth: 0.8mm; Power Rating: 100mW; Width: 0.8mm; Height: 0.55mm; Radiation Hardening: No; Case Code (Imperial): 0603; Number of Pins: 2; Length: 1.6mm; Case Code (Metric): 1608; Max Operating Temperature: 85°C; Color: Green; Packaging: Tape and Reel; Mount: Surface Mount; Min Operating Temperature: -55°C; Lead Free: Lead Free; Number of LEDs: 1
FB2 = CMP-0686-00575-3: Chip Ferrite Bead, 0603, 60Ω @ 100MHz, 0.1Ω, , 1A; ESR (Equivalent Series Resistance): 60R; Number of Lines: 1; Material: Steel; Tolerance: 25%; Shielding: Unshielded; Current Rating: 500mA; Resistance: 100mR; Package Quantity: 1; Termination: SMD/SMT; Lead Free: Lead Free; Max Operating Temperature: 125°C; Number of Circuits: 1; Length: 1.6mm; Min Operating Temperature: -55°C; Case Code (Metric): 1608; Max DC Current: 500mA; REACH SVHC: No SVHC; Frequency: 100MHz; Number of Pins: 2; RoHS Compliant: Yes; Height: 0.8mm; Depth: 0.8mm; Width: 0.8mm; Test Frequency: 100MHz; Case/Package: 0603; Impedance: 60R; Max Current Rating: 500mA; Packaging: Tape and Reel; DC Resistance (DCR): 100mR; Case Code (Imperial): 0603; Core Material: Ferrite
J3 = 43860-0010: Modular Jack Right Angle 8/8 RJ45 Invert Molex Cat3 RJ45 Modular Jack Socket, Right Angle, Through Hole 43860 / 43860-0010; Geometry.Height: 13.79mm; Mouser Part Number: 538-43860-0010; Mouser Price/Stock: https://www.mouser.co.uk/ProductDetail/Molex/43860-0010?qs=qjii0NTOo%252B4EzowI%2FkFJuQ%3D%3D; Manufacturer_Name: Molex; Manufacturer_Part_Number: 43860-0010; Datasheet Link: https://www.molex.com/webdocs/datasheets/pdf/en-us/0438600010_MODULAR_JACKS_PLUG.pdf
R13 = CMP-2000-03816-5: 0603; Manufacturer: Vishay Semiconductor; Voltage Rating: 75 V; Package Quantity: 5000; DatasheetVersion: 06/2012; Min Operating Temperature: -55 degC; ComponentLink1URL: http://www.vishay.com/; Mounting Technology: Surface Mount; Height: 0.45 mm; ComponentLink1Description: Manufacturer URL; REACH SVHC: Unknown; PackageReference: 0603; Packaging: Tape and Reel; Max Operating Temperature: 155 degC; Mount: Surface Mount; ComponentLink2Description: Datasheet; PackageDescription: 2-Pin Surface Mount Device, Body 1.575 x 0.85 mm; Length: 1.55 mm; ComponentLink2URL: http://www.vishay.com/docs/20035/dcrcwe3.pdf; Pins: 2; RoHSCompliant: true
R14-R36 = CMP-2001-04896-1: as R9 on sheet MCU
U6 = CMP-0058-00351-5: IC TRANSCEIVER 1/1 40WQFN; Number of Ports: 1; Cable Length: 137m; Data Rate: 100Mbps; Interface: Serial; Max Power Dissipation: 264mW; Nominal Supply Current: 92mA; Operating Supply Voltage: 3.3V; Max Supply Voltage: 3.6V; Min Supply Voltage: 3V; Series: DP83848M; Packaging: Tape and Reel; Number of Transceivers: 1; Max Operating Temperature: 70°C; Number of Channels: 1; Lead Free: Lead Free; Height: 0.8mm; Termination: SMD/SMT; Min Operating Temperature: 0°C; Mount: Surface Mount; Width: 4.6mm; Package Quantity: 250; Radiation Hardening: No; RoHS Compliant: Yes; REACH SVHC: No SVHC; Length: 4.6mm; Number of Pins: 40; Supply Current: 92mA
U7 = PT61017PEL: 350 µH LAN 10/100 Base-T Pulse Transformer 1CT:1CT Surface Mount / PT61017PEL; MF: Bourns; Package: SMD-16 Bourns; Price: None; Availability: In Stock; Purchase-URL: https://pricing.snapeda.com/search/part/PT61017PEL/?ref=eda; Check_prices: https://www.snapeda.com/parts/PT61017PEL/Bourns/view-part/?ref=eda; MP: PT61017PEL; SnapEDA_Link: https://www.snapeda.com/parts/PT61017PEL/Bourns/view-part/?ref=snap; Value: *

## Sheet ECAT1_(OUT).SchDoc
size A3; SheetNumber: 4; SheetTotal: 7
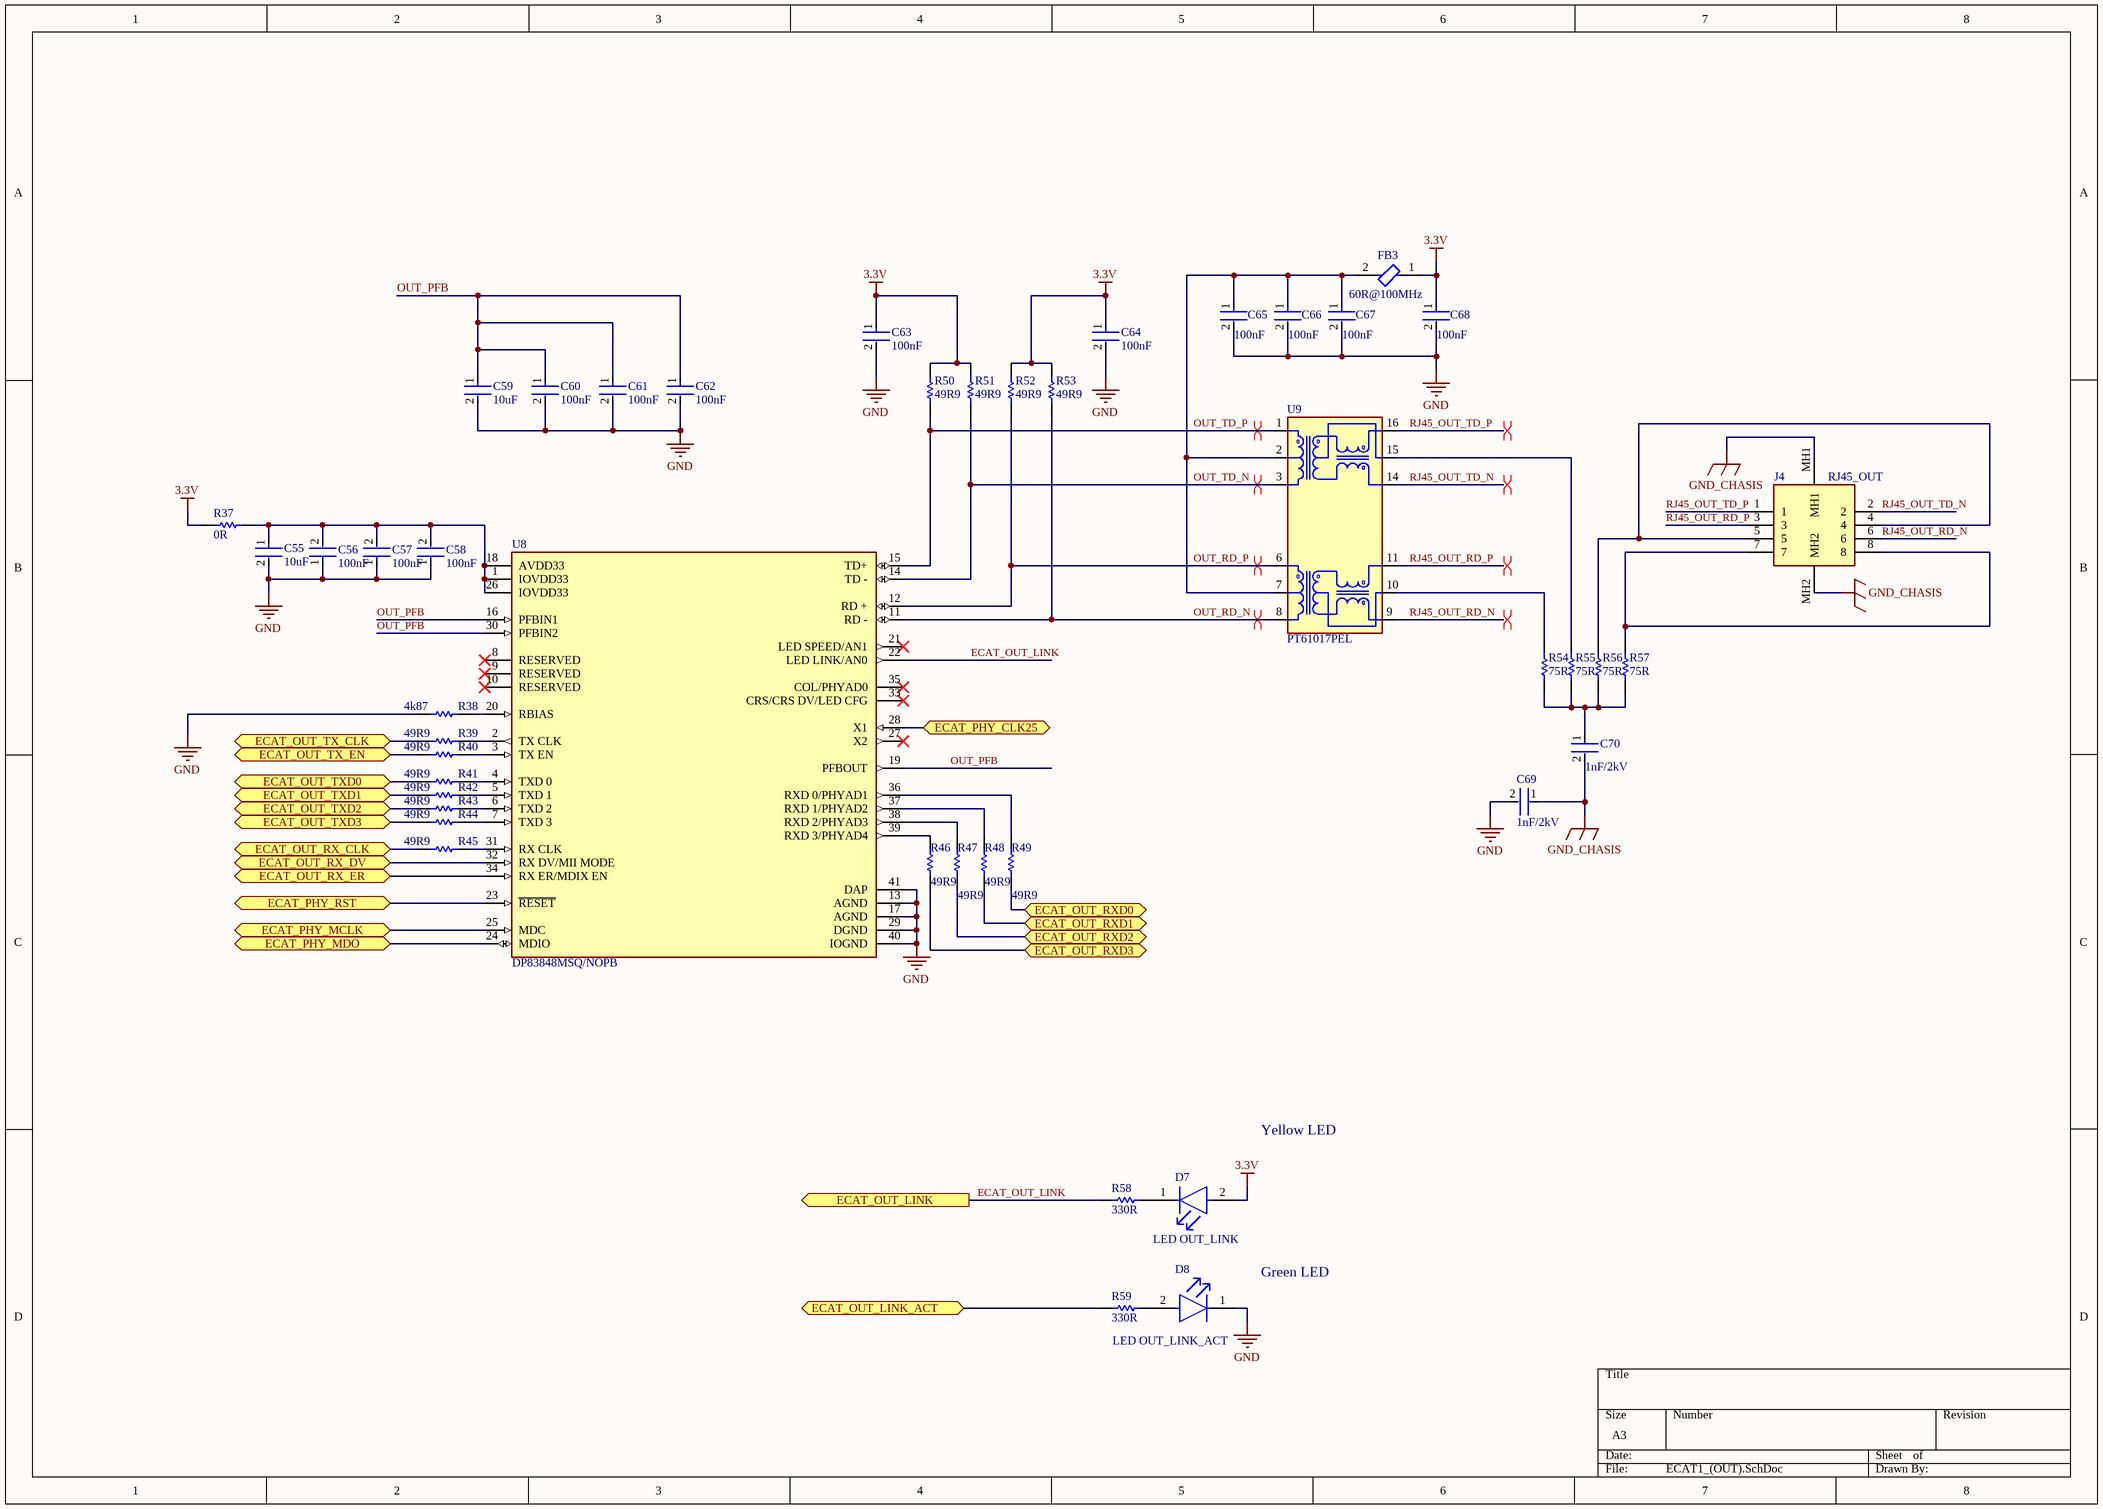
[diagram p3: ECAT1_(OUT).SchDoc]

### Parts
C55  10uF  [FP-C0805C-DN-MFG]
C56  100nF  [FP-C0805C-DN-MFG]
C57  100nF  [FP-C0805C-DN-MFG]
C58  100nF  [FP-C0805C-DN-MFG]
C59  10uF  [FP-C0805C-DN-MFG]
C60  100nF  [FP-C0805C-DN-MFG]
C61  100nF  [FP-C0805C-DN-MFG]
C62  100nF  [FP-C0805C-DN-MFG]
C63  100nF  [FP-C0805C-DN-MFG]
C64  100nF  [FP-C0805C-DN-MFG]
C65  100nF  [FP-C0805C-DN-MFG]
C66  100nF  [FP-C0805C-DN-MFG]
C67  100nF  [FP-C0805C-DN-MFG]
C68  100nF  [FP-C0805C-DN-MFG]
C69  1nF/2kV  [FP-CC1206-0_3-1_45-IPC_C]
C70  1nF/2kV  [FP-CC1206-0_3-1_45-IPC_C]
D7  LED OUT_LINK  [FP-LTST-C191GKT-MFG]
D8  LED OUT_LINK_ACT  [FP-LTST-C191GKT-MFG]
FB3  60R@100MHz  [FP-BLM18-0_15-t0_8-IPC_B]
J4  RJ45_OUT  [438600010]
R37  0R  [RESC1609X50X30NL8T20]
R38  4k87  [RESC2013X50X30LL20T20]
R39  49R9  [RESC2013X50X30LL20T20]
R40  49R9  [RESC2013X50X30LL20T20]
R41  49R9  [RESC2013X50X30LL20T20]
R42  49R9  [RESC2013X50X30LL20T20]
R43  49R9  [RESC2013X50X30LL20T20]
R44  49R9  [RESC2013X50X30LL20T20]
R45  49R9  [RESC2013X50X30LL20T20]
R46  49R9  [RESC2013X50X30LL20T20]
R47  49R9  [RESC2013X50X30LL20T20]
R48  49R9  [RESC2013X50X30LL20T20]
R49  49R9  [RESC2013X50X30LL20T20]
R50  49R9  [RESC2013X50X30LL20T20]
R51  49R9  [RESC2013X50X30LL20T20]
R52  49R9  [RESC2013X50X30LL20T20]
R53  49R9  [RESC2013X50X30LL20T20]
R54  75R  [RESC2013X50X30LL20T20]
R55  75R  [RESC2013X50X30LL20T20]
R56  75R  [RESC2013X50X30LL20T20]
R57  75R  [RESC2013X50X30LL20T20]
R58  330R  [RESC2013X50X30LL20T20]
R59  330R  [RESC2013X50X30LL20T20]
U8  DP83848MSQ/NOPB  [FP-RTA0040A-IPC_B]
U9  PT61017PEL  [PT61017PEL]

### Ports
ECAT_OUT_LINK (out, see MCU[7B]), ECAT_OUT_LINK_ACT (bidir, see MCU[5B]), ECAT_OUT_RX_CLK (bidir, see MCU[5B]), ECAT_OUT_RX_DV (bidir, see MCU[5C]), ECAT_OUT_RX_ER (bidir, see MCU[7B]), ECAT_OUT_RXD0 (bidir, see MCU[7B]), ECAT_OUT_RXD1 (bidir, see MCU[5B]), ECAT_OUT_RXD2 (bidir, see MCU[5B]), ECAT_OUT_RXD3 (bidir, see MCU[5B]), ECAT_OUT_TX_CLK (bidir, see MCU[5B]), ECAT_OUT_TX_EN (bidir, see MCU[5A]), ECAT_OUT_TXD0 (bidir, see MCU[5A]), ECAT_OUT_TXD1 (bidir, see MCU[5B]), ECAT_OUT_TXD2 (bidir, see MCU[5B]), ECAT_OUT_TXD3 (bidir, see MCU[5B]), ECAT_PHY_CLK25 (bidir, see ECAT0_(IN)[4B], MCU[6D]), ECAT_PHY_MCLK (bidir, see ECAT0_(IN)[1C], MCU[5B]), ECAT_PHY_MDO (bidir, see ECAT0_(IN)[1C], MCU[5B]), ECAT_PHY_RST (bidir, see ECAT0_(IN)[1C], MCU[6C])

### Nets
3.3V: C63.1 C64.1 C68.1 D7.2(A) FB3.1 R37.2 R50.2 R51.2 R52.2 R53.2
GND: C55.2 C56.1 C57.1 C58.1 C59.2 C60.2 C61.2 C62.2 C63.2 C64.2 C65.2 C66.2 C67.2 C68.2 C69.2 D8.1(C) R38.1 U8.13(AGND) U8.17(AGND) U8.29(DGND) U8.40(IOGND) U8.41(DAP)
GND_CHASIS: C69.1 C70.2 J4.MH1 J4.MH2
ECAT_OUT_LINK: R58.1 U8.22(LED_LINK/AN0) ; port ECAT_OUT_LINK
ECAT_OUT_LINK_ACT: R59.1 ; port ECAT_OUT_LINK_ACT
ECAT_OUT_RX_CLK: R45.1 ; port ECAT_OUT_RX_CLK
ECAT_OUT_RX_DV: U8.32(RX_DV/MII_MODE) ; port ECAT_OUT_RX_DV
ECAT_OUT_RX_ER: U8.34(RX_ER/MDIX_EN) ; port ECAT_OUT_RX_ER
ECAT_OUT_RXD0: R49.1 ; port ECAT_OUT_RXD0
ECAT_OUT_RXD1: R48.1 ; port ECAT_OUT_RXD1
ECAT_OUT_RXD2: R47.1 ; port ECAT_OUT_RXD2
ECAT_OUT_RXD3: R46.1 ; port ECAT_OUT_RXD3
ECAT_OUT_TX_CLK: R39.1 ; port ECAT_OUT_TX_CLK
ECAT_OUT_TX_EN: R40.1 ; port ECAT_OUT_TX_EN
ECAT_OUT_TXD0: R41.1 ; port ECAT_OUT_TXD0
ECAT_OUT_TXD1: R42.1 ; port ECAT_OUT_TXD1
ECAT_OUT_TXD2: R43.1 ; port ECAT_OUT_TXD2
ECAT_OUT_TXD3: R44.1 ; port ECAT_OUT_TXD3
ECAT_PHY_CLK25: U8.28(X1) ; port ECAT_PHY_CLK25
ECAT_PHY_MCLK: U8.25(MDC) ; port ECAT_PHY_MCLK
ECAT_PHY_MDO: U8.24(MDIO) ; port ECAT_PHY_MDO
ECAT_PHY_RST: U8.23(~{RESET}) ; port ECAT_PHY_RST
OUT_PFB: C59.1 C60.1 C61.1 C62.1 U8.16(PFBIN1) U8.19(PFBOUT) U8.30(PFBIN2)
OUT_RD_N: R53.1 U8.11(RD_-) U9.8
OUT_RD_P: R52.1 U8.12(RD_+) U9.6
OUT_TD_N: R51.1 U8.14(TD_-) U9.3
OUT_TD_P: R50.1 U8.15(TD+) U9.1
RJ45_OUT_RD_N: J4.6 U9.9
RJ45_OUT_RD_P: J4.3 U9.11
RJ45_OUT_TD_N: J4.2 U9.14
RJ45_OUT_TD_P: J4.1 U9.16
NetC55_1: C55.1 C56.2 C57.2 C58.2 R37.1 U8.1(IOVDD33) U8.18(AVDD33) U8.26(IOVDD33)
NetC65_1: C65.1 C66.1 C67.1 FB3.2 U9.2 U9.7
NetC70_1: C70.1 R54.1 R55.1 R56.1 R57.1
NetD7_1: D7.1(C) R58.2
NetD8_2: D8.2(A) R59.2
NetJ4_4: J4.4 J4.5 R56.2
NetJ4_7: J4.7 J4.8 R57.2
NetR38_2: R38.2 U8.20(RBIAS)
NetR39_2: R39.2 U8.2(TX_CLK)
NetR40_2: R40.2 U8.3(TX_EN)
NetR41_2: R41.2 U8.4(TXD_0)
NetR42_2: R42.2 U8.5(TXD_1)
NetR43_2: R43.2 U8.6(TXD_2)
NetR44_2: R44.2 U8.7(TXD_3)
NetR45_2: R45.2 U8.31(RX_CLK)
NetR46_2: R46.2 U8.39(RXD_3/PHYAD4)
NetR47_2: R47.2 U8.38(RXD_2/PHYAD3)
NetR48_2: R48.2 U8.37(RXD_1/PHYAD2)
NetR49_2: R49.2 U8.36(RXD_0/PHYAD1)
NetR54_2: R54.2 U9.10
NetR55_2: R55.2 U9.15

Not connected (* = marked no-connect by the designer): U8 8(RESERVED)* 9(RESERVED)* 10(RESERVED)* 21(LED_SPEED/AN1)* 27(X2)* 33(CRS/CRS_DV/LED_CFG)* 35(COL/PHYAD0)*

### Layout directives
differential pair; differential pair class OUT_TD: OUT_TD_N, OUT_TD_P
differential pair; differential pair class OUT_RD: OUT_RD_N, OUT_RD_P
differential pair; differential pair class RJ45_OUT_TD: RJ45_OUT_TD_N, RJ45_OUT_TD_P
differential pair; differential pair class RJ45_OUT_RD: RJ45_OUT_RD_N, RJ45_OUT_RD_P

### Notes on the sheet
- Yellow LED
- Green LED

### Library data of the parts
C55-C68 = CMP-2007-00279-2: as C22 on sheet MCU; Device Class L2: Capacitors; Temperature Range Low: -55°C; Voltage Rating: 50 V; Digikey Description: CAP CER 0.1UF 50V X7R 0805; Category: Cap; ComponentLink2Description: Datasheet; Octopart: https://octopart.com/c0805c104k5ractu-kemet-143926; RoHS: TRUE; ComponentLink2URL: https://content.kemet.com/datasheets/KEM_C1003_C0G_SMD.pdf; Temperature Characteristic: X7R; Temperature: -55°C to +125°C; Height: 0.88mm; Temperature Range High: +125°C; Device Class L1: Passive Components; Automotive: No; Lead Free: Yes; Ipc Land Pattern Name: CAPC200125X78; Device Class L3: Ceramic Capacitors; Mouser Description: Cap Ceramic 0.1uF 50V X7R 10% SMD 2.0 x 1.2 mm 125 C Paper T/R; Capacitance: 0.10 μF; Package: C0805C-DN
C69 C70 = CMP-2000-05436-2: as C53 on sheet ECAT0_(IN); Termination: SMD/SMT; Case/Package: 1206; Length: 3.2mm; Depth: 1.6mm; Case Code (Imperial): 1206; Package Quantity: 1; Packaging: Tape and Reel; Mount: Surface Mount; Max Operating Temperature: 125°C; Lead Free: Lead Free; Number of Pins: 2; Thickness: 0.057inch; Width: 0.063inch; Resistor Type: Ceramic; Series: CC; RoHS Compliant: Yes; Voltage Rating: 2kV; Radiation Hardening: No; Construction: Flat; Height: 1.25mm; Min Operating Temperature: -55°C; Voltage: 2kV; Case Code (Metric): 3216
D7 = CMP-22017-000029-1: as D5 on sheet ECAT0_(IN); Case/Package: 0603; Package Quantity: 1; Lens Transparency: Clear; Depth: 0.8mm; Power Rating: 100mW; Width: 0.8mm; Height: 0.55mm; Radiation Hardening: No; Case Code (Imperial): 0603; Number of Pins: 2; Length: 1.6mm; Case Code (Metric): 1608; Max Operating Temperature: 85°C; Color: Green; Packaging: Tape and Reel; Mount: Surface Mount; Min Operating Temperature: -55°C; Lead Free: Lead Free; Number of LEDs: 1
D8 = CMP-22017-000029-1: as D3 on sheet MCU; Case/Package: 0603; Package Quantity: 1; Lens Transparency: Clear; Depth: 0.8mm; Power Rating: 100mW; Width: 0.8mm; Height: 0.55mm; Radiation Hardening: No; Case Code (Imperial): 0603; Number of Pins: 2; Length: 1.6mm; Case Code (Metric): 1608; Max Operating Temperature: 85°C; Color: Green; Packaging: Tape and Reel; Mount: Surface Mount; Min Operating Temperature: -55°C; Lead Free: Lead Free; Number of LEDs: 1
FB3 = CMP-0686-00575-3: as FB2 on sheet ECAT0_(IN); Package Quantity: 1; Termination: SMD/SMT; Lead Free: Lead Free; Max Operating Temperature: 125°C; Number of Circuits: 1; Length: 1.6mm; Min Operating Temperature: -55°C; Case Code (Metric): 1608; Max DC Current: 500mA; REACH SVHC: No SVHC; Frequency: 100MHz; Number of Pins: 2; RoHS Compliant: Yes; Height: 0.8mm; Depth: 0.8mm; Width: 0.8mm; Test Frequency: 100MHz; Case/Package: 0603; Impedance: 60R; Max Current Rating: 500mA; Packaging: Tape and Reel; DC Resistance (DCR): 100mR; Case Code (Imperial): 0603; Core Material: Ferrite
J4 = 43860-0010: as J3 on sheet ECAT0_(IN); Mouser Part Number: 538-43860-0010; Mouser Price/Stock: https://www.mouser.co.uk/ProductDetail/Molex/43860-0010?qs=qjii0NTOo%252B4EzowI%2FkFJuQ%3D%3D; Manufacturer_Name: Molex; Manufacturer_Part_Number: 43860-0010; Datasheet Link: https://www.molex.com/webdocs/datasheets/pdf/en-us/0438600010_MODULAR_JACKS_PLUG.pdf
R37 = CMP-2000-03816-5: as R13 on sheet ECAT0_(IN); Package Quantity: 5000; DatasheetVersion: 06/2012; Min Operating Temperature: -55 degC; ComponentLink1URL: http://www.vishay.com/; Mounting Technology: Surface Mount; Height: 0.45 mm; ComponentLink1Description: Manufacturer URL; REACH SVHC: Unknown; PackageReference: 0603; Packaging: Tape and Reel; Max Operating Temperature: 155 degC; Mount: Surface Mount; ComponentLink2Description: Datasheet; PackageDescription: 2-Pin Surface Mount Device, Body 1.575 x 0.85 mm; Length: 1.55 mm; ComponentLink2URL: http://www.vishay.com/docs/20035/dcrcwe3.pdf; Pins: 2; RoHSCompliant: true
R38-R59 = CMP-2001-04896-1: as R9 on sheet MCU
U8 = CMP-0058-00351-5: as U6 on sheet ECAT0_(IN); Series: DP83848M; Packaging: Tape and Reel; Number of Transceivers: 1; Max Operating Temperature: 70°C; Number of Channels: 1; Lead Free: Lead Free; Height: 0.8mm; Termination: SMD/SMT; Min Operating Temperature: 0°C; Mount: Surface Mount; Width: 4.6mm; Package Quantity: 250; Radiation Hardening: No; RoHS Compliant: Yes; REACH SVHC: No SVHC; Length: 4.6mm; Number of Pins: 40; Supply Current: 92mA
U9 = PT61017PEL: as U7 on sheet ECAT0_(IN); Package: SMD-16 Bourns; Price: None; Availability: In Stock; Purchase-URL: https://pricing.snapeda.com/search/part/PT61017PEL/?ref=eda; Check_prices: https://www.snapeda.com/parts/PT61017PEL/Bourns/view-part/?ref=eda; MP: PT61017PEL; SnapEDA_Link: https://www.snapeda.com/parts/PT61017PEL/Bourns/view-part/?ref=snap; Value: *

## Sheet MOSFET.SchDoc
size A4; SheetNumber: 5; SheetTotal: 7
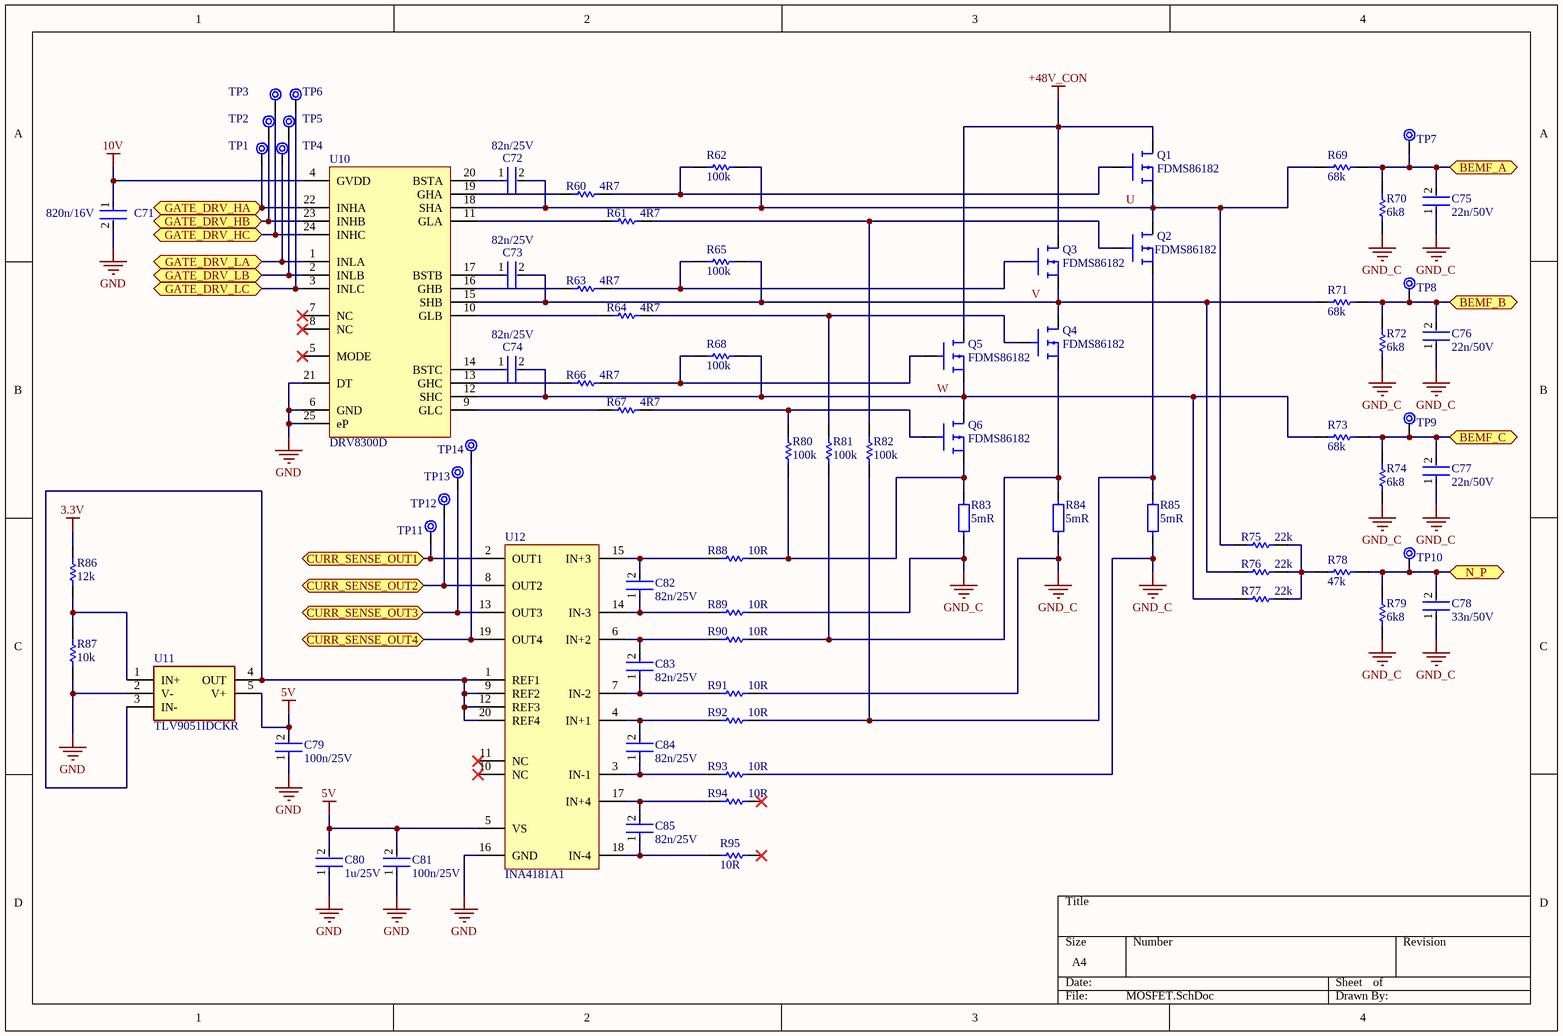
[diagram p4: MOSFET.SchDoc]

### Parts
C71  820n/16V  [FP-C0805C-DN-MFG]
C72  82n/25V  [FP-C0805C-DN-MFG]
C73  82n/25V  [FP-C0805C-DN-MFG]
C74  82n/25V  [FP-C0805C-DN-MFG]
C75  22n/50V  [FP-C0805C-DN-MFG]
C76  22n/50V  [FP-C0805C-DN-MFG]
C77  22n/50V  [FP-C0805C-DN-MFG]
C78  33n/50V  [FP-C0805C-DN-MFG]
C79  100n/25V  [FP-C0805C-DN-MFG]
C80  1u/25V  [FP-C0805C-DN-MFG]
C81  100n/25V  [FP-C0805C-DN-MFG]
C82  82n/25V  [FP-C0805C-DN-MFG]
C83  82n/25V  [FP-C0805C-DN-MFG]
C84  82n/25V  [FP-C0805C-DN-MFG]
C85  82n/25V  [FP-C0805C-DN-MFG]
Q1  FDMS86182  [FDMS86182]
Q2  FDMS86182  [FDMS86182]
Q3  FDMS86182  [FDMS86182]
Q4  FDMS86182  [FDMS86182]
Q5  FDMS86182  [FDMS86182]
Q6  FDMS86182  [FDMS86182]
R60  4R7  [RESC2013X50X30LL20T20]
R61  4R7  [RESC2013X50X30LL20T20]
R62  100k  [RESC2013X50X30LL20T20]
R63  4R7  [RESC2013X50X30LL20T20]
R64  4R7  [RESC2013X50X30LL20T20]
R65  100k  [RESC2013X50X30LL20T20]
R66  4R7  [RESC2013X50X30LL20T20]
R67  4R7  [RESC2013X50X30LL20T20]
R68  100k  [RESC2013X50X30LL20T20]
R69  68k  [RESC2013X50X30LL20T20]
R70  6k8  [RESC2013X50X30LL20T20]
R71  68k  [RESC2013X50X30LL20T20]
R72  6k8  [RESC2013X50X30LL20T20]
R73  68k  [RESC2013X50X30LL20T20]
R74  6k8  [RESC2013X50X30LL20T20]
R75  22k  [RESC2013X50X30LL20T20]
R76  22k  [RESC2013X50X30LL20T20]
R77  22k  [RESC2013X50X30LL20T20]
R78  47k  [RESC2013X50X30LL20T20]
R79  6k8  [RESC2013X50X30LL20T20]
R80  100k  [RESC2013X50X30LL20T20]
R81  100k  [RESC2013X50X30LL20T20]
R82  100k  [RESC2013X50X30LL20T20]
R83  value 5mR  [RESC6432X08N]  (hidden comment: 5mR/2512)
R84  value 5mR  [RESC6432X08N]  (hidden comment: 5mR/2512)
R85  value 5mR  [RESC6432X08N]  (hidden comment: 5mR/2512)
R86  12k  [RESC2013X50X30LL20T20]
R87  10k  [RESC2013X50X30LL20T20]
R88  10R  [RESC2013X50X30LL20T20]
R89  10R  [RESC2013X50X30LL20T20]
R90  10R  [RESC2013X50X30LL20T20]
R91  10R  [RESC2013X50X30LL20T20]
R92  10R  [RESC2013X50X30LL20T20]
R93  10R  [RESC2013X50X30LL20T20]
R94  10R  [RESC2013X50X30LL20T20]
R95  10R  [RESC2013X50X30LL20T20]
TP1  Test Point 1mm  [Pad 1mm]  (value not drawn)
TP2  Test Point 1mm  [Pad 1mm]  (value not drawn)
TP3  Test Point 1mm  [Pad 1mm]  (value not drawn)
TP4  Test Point 1mm  [Pad 1mm]  (value not drawn)
TP5  Test Point 1mm  [Pad 1mm]  (value not drawn)
TP6  Test Point 1mm  [Pad 1mm]  (value not drawn)
TP7  Test Point 1mm  [Pad 1mm]  (value not drawn)
TP8  Test Point 1mm  [Pad 1mm]  (value not drawn)
TP9  Test Point 1mm  [Pad 1mm]  (value not drawn)
TP10  Test Point 1mm  [Pad 1mm]  (value not drawn)
TP11  Test Point 1mm  [Pad 1mm]  (value not drawn)
TP12  Test Point 1mm  [Pad 1mm]  (value not drawn)
TP13  Test Point 1mm  [Pad 1mm]  (value not drawn)
TP14  Test Point 1mm  [Pad 1mm]  (value not drawn)
U10  DRV8300D  [PQFN50P400X400X100_HS-25N]
U11  TLV9051IDCKR  [SOT65P210X110-5N]
U12  INA4181A1  [TSOP65P640X120-20N]

### Ports
BEMF_A (bidir, see MCU[7A]), BEMF_B (bidir, see MCU[7A]), BEMF_C (bidir, see MCU[7A]), CURR_SENSE_OUT1 (bidir, see MCU[7B]), CURR_SENSE_OUT2 (bidir, see MCU[7B]), CURR_SENSE_OUT3 (bidir, see MCU[7A]), CURR_SENSE_OUT4 (bidir, see MCU[7A]), GATE_DRV_HA (bidir, see MCU[5A]), GATE_DRV_HB (bidir, see MCU[5A]), GATE_DRV_HC (bidir, see MCU[5A]), GATE_DRV_LA (bidir, see MCU[5A]), GATE_DRV_LB (bidir, see MCU[5A]), GATE_DRV_LC (bidir, see MCU[5A]), N_P (bidir, see MCU[7B])

### Nets
3.3V: R86.1
5V: C79.2 C80.2 C81.2 U11.5(V+) U12.5(VS)
10V: C71.1 U10.4(GVDD)
+48V_CON: Q1.D Q3.D Q5.D
GND: C71.2 C79.1 C80.1 C81.1 R87.2 U10.6(GND) U10.21(DT) U10.25(eP) U11.2(V-) U12.16(GND)
GND_C: C75.1 C76.1 C77.1 C78.1 R70.2 R72.2 R74.2 R79.2 R83.1 R84.1 R85.1 R89.1 R91.1 R93.1
BEMF_A: C75.2 R69.1 R70.1 TP7.1 ; port BEMF_A
BEMF_B: C76.2 R71.1 R72.1 TP8.1 ; port BEMF_B
BEMF_C: C77.2 R73.1 R74.1 TP9.1 ; port BEMF_C
CURR_SENSE_OUT1: TP11.1 U12.2(OUT1) ; port CURR_SENSE_OUT1
CURR_SENSE_OUT2: TP12.1 U12.8(OUT2) ; port CURR_SENSE_OUT2
CURR_SENSE_OUT3: TP13.1 U12.13(OUT3) ; port CURR_SENSE_OUT3
CURR_SENSE_OUT4: TP14.1 U12.19(OUT4) ; port CURR_SENSE_OUT4
GATE_DRV_HA: TP1.1 U10.22(INHA) ; port GATE_DRV_HA
GATE_DRV_HB: TP2.1 U10.23(INHB) ; port GATE_DRV_HB
GATE_DRV_HC: TP3.1 U10.24(INHC) ; port GATE_DRV_HC
GATE_DRV_LA: TP4.1 U10.1(INLA) ; port GATE_DRV_LA
GATE_DRV_LB: TP5.1 U10.2(INLB) ; port GATE_DRV_LB
GATE_DRV_LC: TP6.1 U10.3(INLC) ; port GATE_DRV_LC
N_P: C78.2 R78.1 R79.1 TP10.1 ; port N_P
U: C72.2 Q1.S Q2.D R62.1 R69.2 R75.2 U10.18(SHA)
V: C73.2 Q3.S Q4.D R65.1 R71.2 R76.2 U10.15(SHB)
W: C74.2 Q5.S Q6.D R68.1 R73.2 R77.2 U10.12(SHC)
NetC72_1: C72.1 U10.20(BSTA)
NetC73_1: C73.1 U10.17(BSTB)
NetC74_1: C74.1 U10.14(BSTC)
NetC82_1: C82.1 R89.2 U12.14(IN-3)
NetC82_2: C82.2 R88.2 U12.15(IN+3)
NetC83_1: C83.1 R91.2 U12.7(IN-2)
NetC83_2: C83.2 R90.2 U12.6(IN+2)
NetC84_1: C84.1 R93.2 U12.3(IN-1)
NetC84_2: C84.2 R92.2 U12.4(IN+1)
NetC85_1: C85.1 R95.2 U12.18(IN-4)
NetC85_2: C85.2 R94.2 U12.17(IN+4)
NetQ1_G: Q1.G R60.1 R62.2
NetQ2_G: Q2.G R61.1 R82.1
NetQ2_S: Q2.S R82.2 R85.2 R92.1
NetQ3_G: Q3.G R63.1 R65.2
NetQ4_G: Q4.G R64.1 R81.1
NetQ4_S: Q4.S R81.2 R84.2 R90.1
NetQ5_G: Q5.G R66.1 R68.2
NetQ6_G: Q6.G R67.1 R80.1
NetQ6_S: Q6.S R80.2 R83.2 R88.1
NetR60_2: R60.2 U10.19(GHA)
NetR61_2: R61.2 U10.11(GLA)
NetR63_2: R63.2 U10.16(GHB)
NetR64_2: R64.2 U10.10(GLB)
NetR66_2: R66.2 U10.13(GHC)
NetR67_2: R67.2 U10.9(GLC)
NetR75_1: R75.1 R76.1 R77.1 R78.2
NetR86_2: R86.2 R87.1 U11.1(IN+)
NetU11_3: U11.3(IN-) U11.4(OUT) U12.1(REF1) U12.9(REF2) U12.12(REF3) U12.20(REF4)

Not connected (* = marked no-connect by the designer): R94 1*; R95 1*; U10 5(MODE)* 7(NC)* 8(NC)*; U12 10(NC)* 11(NC)*

### Library data of the parts
C71-C85 = CMP-2007-00279-2: as C22 on sheet MCU; Device Class L2: Capacitors; Temperature Range Low: -55°C; Voltage Rating: 50 V; Digikey Description: CAP CER 0.1UF 50V X7R 0805; Category: Cap; ComponentLink2Description: Datasheet; Octopart: https://octopart.com/c0805c104k5ractu-kemet-143926; RoHS: TRUE; ComponentLink2URL: https://content.kemet.com/datasheets/KEM_C1003_C0G_SMD.pdf; Temperature Characteristic: X7R; Temperature: -55°C to +125°C; Height: 0.88mm; Temperature Range High: +125°C; Device Class L1: Passive Components; Automotive: No; Lead Free: Yes; Ipc Land Pattern Name: CAPC200125X78; Device Class L3: Ceramic Capacitors; Mouser Description: Cap Ceramic 0.1uF 50V X7R 10% SMD 2.0 x 1.2 mm 125 C Paper T/R; Capacitance: 0.10 μF; Package: C0805C-DN
Q1-Q6 = FDMS86182: MOSFET PTNG 100/20V Nch Power Trench MOSFET; Manufacturer: Onsemi; Distributor 1: Mouser; Distributor 1 ID: 512-FDMS86182; Part Number: FDMS86182; Second Source: *; ComponentLink1Description: Datasheet; ComponentLink1URL: https://www.mouser.pl/datasheet/2/308/1/FDMS86182_D-2312683.pdf; ComponentLink2Description: Distributor 1; ComponentLink2URL: https://www.mouser.pl/ProductDetail/onsemi-Fairchild/FDMS86182?qs=V471yVjZJ9utOAPYzzuTZA%3D%3D
R60-R82 R86-R95 = CMP-2001-04896-1: as R9 on sheet MCU
R83-R85 = RES/5mR/1%/2512: Current Sense Resistors - SMD 0.005ohms 1% 75PPM; Manufacturer: Vishay; Part Number: CRCW0402100RFKEDC; Distributor: Mouser; Distributor ID: 71-CRCW0402100RFKEDC
U10 = DRV8300D: Gate Drivers 100-V max simple 3-phase gate driver with bootstrap diodes 24-VQFN -40 to 125; Manufacturer: Texas Instruments; Part Number: DRV8300DRGER; Distributor: Mouser; Distributor ID: 595-DRV8300DRGER
U11 = TLV9051IDCKR: Operational Amplifiers - Op Amps OPAMP; Manufacturer_Name: Texas Instruments; Geometry.Height: 1.1mm; Mouser Part Number: 595-TLV9051IDCKR; Mouser Price/Stock: https://www.mouser.co.uk/ProductDetail/Texas-Instruments/TLV9051IDCKR?qs=T3oQrply3y8HFppUE%252BGx7w%3D%3D; Manufacturer_Part_Number: TLV9051IDCKR; Datasheet Link: https://www.ti.com/lit/gpn/TLV9051
U12 = INA4181A1: Current Sense Amplifiers 26V, quad channel, bi-directional, 350kHz current sense amplifier 20-TSSOP -40 to 125; Manufacturer: Texas Instruments; Part Number: INA4181A1IPWR; Distributor: Mouser; Distributor ID: 595-INA4181A1IPWR